# EAGLE design ac-ac-conv (EAGLE 7.3.0)

## Sheet 1 of 5: Appliance 1
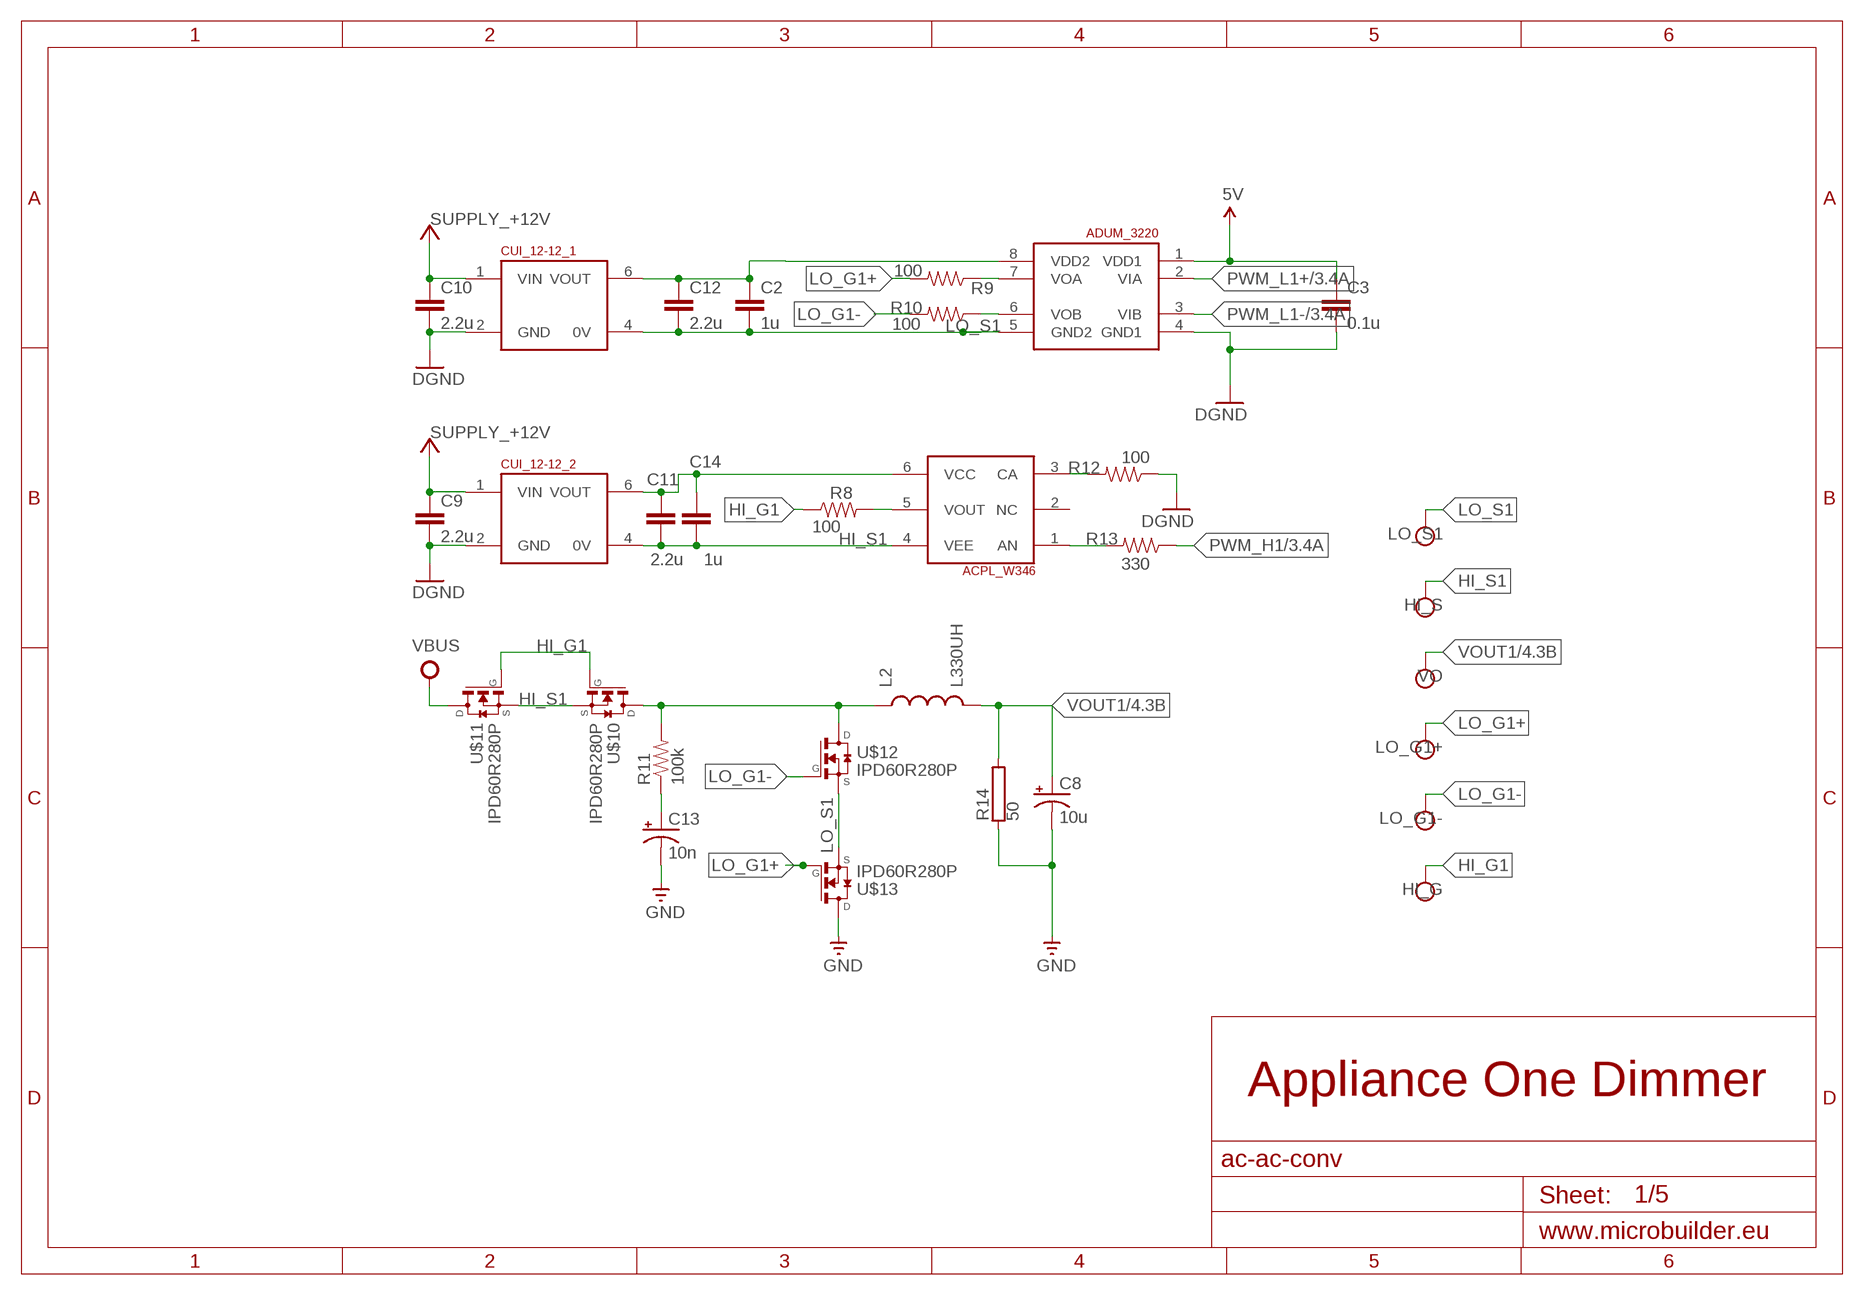
[diagram p0: schematic, sheet 1]

### Parts
ACPL_W346  ACPL-W346-SSO6  [SSO-6]
ADUM_3220  ADUM3220  [SO08]
C2  1u  CAP0603-CAP  [0603-CAP]
C3  0.1u  CAP0603-CAP  [0603-CAP]
C8  10u  CAP_POLC  [PANASONIC_C]
C9  2.2u  CAP0603-CAP  [0603-CAP]
C10  2.2u  CAP0603-CAP  [0603-CAP]
C11  2.2u  CAP0603-CAP  [0603-CAP]
C12  2.2u  CAP0603-CAP  [0603-CAP]
C13  10n  CAP_POL1206  [EIA3216]
C14  1u  CAP0603-CAP  [0603-CAP]
CUI_12-12_1  CUI-S12-S12  [CUI_PDM2]
CUI_12-12_2  CUI-S12-S12  [CUI_PDM2]
HI_G  TESTPOINT0.1"  [1X01_ROUND]
HI_S  TESTPOINT0.1"  [1X01_ROUND]
L2  L330UH  [BOUNRS_330UH]
LO_G1+  TESTPOINT0.1"  [1X01_ROUND]
LO_G1-  TESTPOINT0.1"  [1X01_ROUND]
LO_S1  TESTPOINT0.1"  [1X01_ROUND]
R8  100  RESISTOR0603-RES  [0603-RES]
R9  100  RESISTOR0603-RES  [0603-RES]
R10  100  RESISTOR0603-RES  [0603-RES]
R11  100k  RESISTOR2512  [R2512]
R12  100  RESISTOR0603-RES  [0603-RES]
R13  330  RESISTOR0603-RES  [0603-RES]
R14  50  RMG100-V  [TO-247-2V]
U$10  IPD60R280P  [DPAK]
U$11  IPD60R280P  [DPAK]
U$12  IPD60R280P  [DPAK]
U$13  IPD60R280P  [DPAK]
VO  TESTPOINT0.1"  [1X01_ROUND]

### Nets
5V: ADUM_3220.1(VDD1) C3.1 ; also sheet 2,4,5
+12V: C9.1 C10.1 CUI_12-12_1.1(VIN) CUI_12-12_2.1(VIN) ; supply symbol labelled SUPPLY_+12V ; also sheet 2,5
GND [Power]: ADUM_3220.4(GND1) C3.2 C8.- C9.2 C10.2 C13.C(-) CUI_12-12_1.2(GND) CUI_12-12_2.2(GND) R12.1 R14.1 U$13.4(D) ; supply symbol labelled DGND ; also sheet 2,3,4,5
HI_G1 [Power]: HI_G.1 R8.1 U$10.1(G) U$11.1(G)
HI_PS1: ACPL_W346.6(VCC) C11.1 C14.1 CUI_12-12_2.6(VOUT)
HI_S1: ACPL_W346.4(VEE) C11.2 C14.2 CUI_12-12_2.4(0V) HI_S.1 U$10.3(S) U$11.3(S)
LO_G1+: LO_G1+.1 R9.2 U$13.1(G)
LO_G1-: LO_G1-.1 R10.2 U$12.1(G)
LO_PS1: ADUM_3220.8(VDD2) C2.1 C12.1 CUI_12-12_1.6(VOUT)
LO_S1 [Power]: ADUM_3220.5(GND2) C2.2 C12.2 CUI_12-12_1.4(0V) LO_S1.1 U$12.3(S) U$13.3(S)
N$9 [Power]: L2.P$1 R11.2 U$10.4(D) U$12.4(D)
N$11 [Power]: C13.A(+) R11.1
N$12: ACPL_W346.3(CA) R12.2
N$13: ACPL_W346.1(AN) R13.2
N$14 [Power]: ADUM_3220.7(VOA) R9.1
N$23 [Power]: ADUM_3220.6(VOB) R10.1
PWM_H1: R13.1 ; also sheet 3,5
PWM_L1+: ADUM_3220.2(VIA) ; also sheet 3
PWM_L1-: ADUM_3220.3(VIB) ; also sheet 3
VBUS [Power]: U$11.4(D) ; also sheet 2,4
VOUT1 [Power]: C8.+ L2.P$2 R14.2 VO.1 ; also sheet 4
VOUT_H2: ACPL_W346.5(VOUT) R8.2
Unconnected: ACPL_W346.2(NC)

### Notes on the sheet
- Appliance One Dimmer

## Sheet 2 of 5: Appliance 2
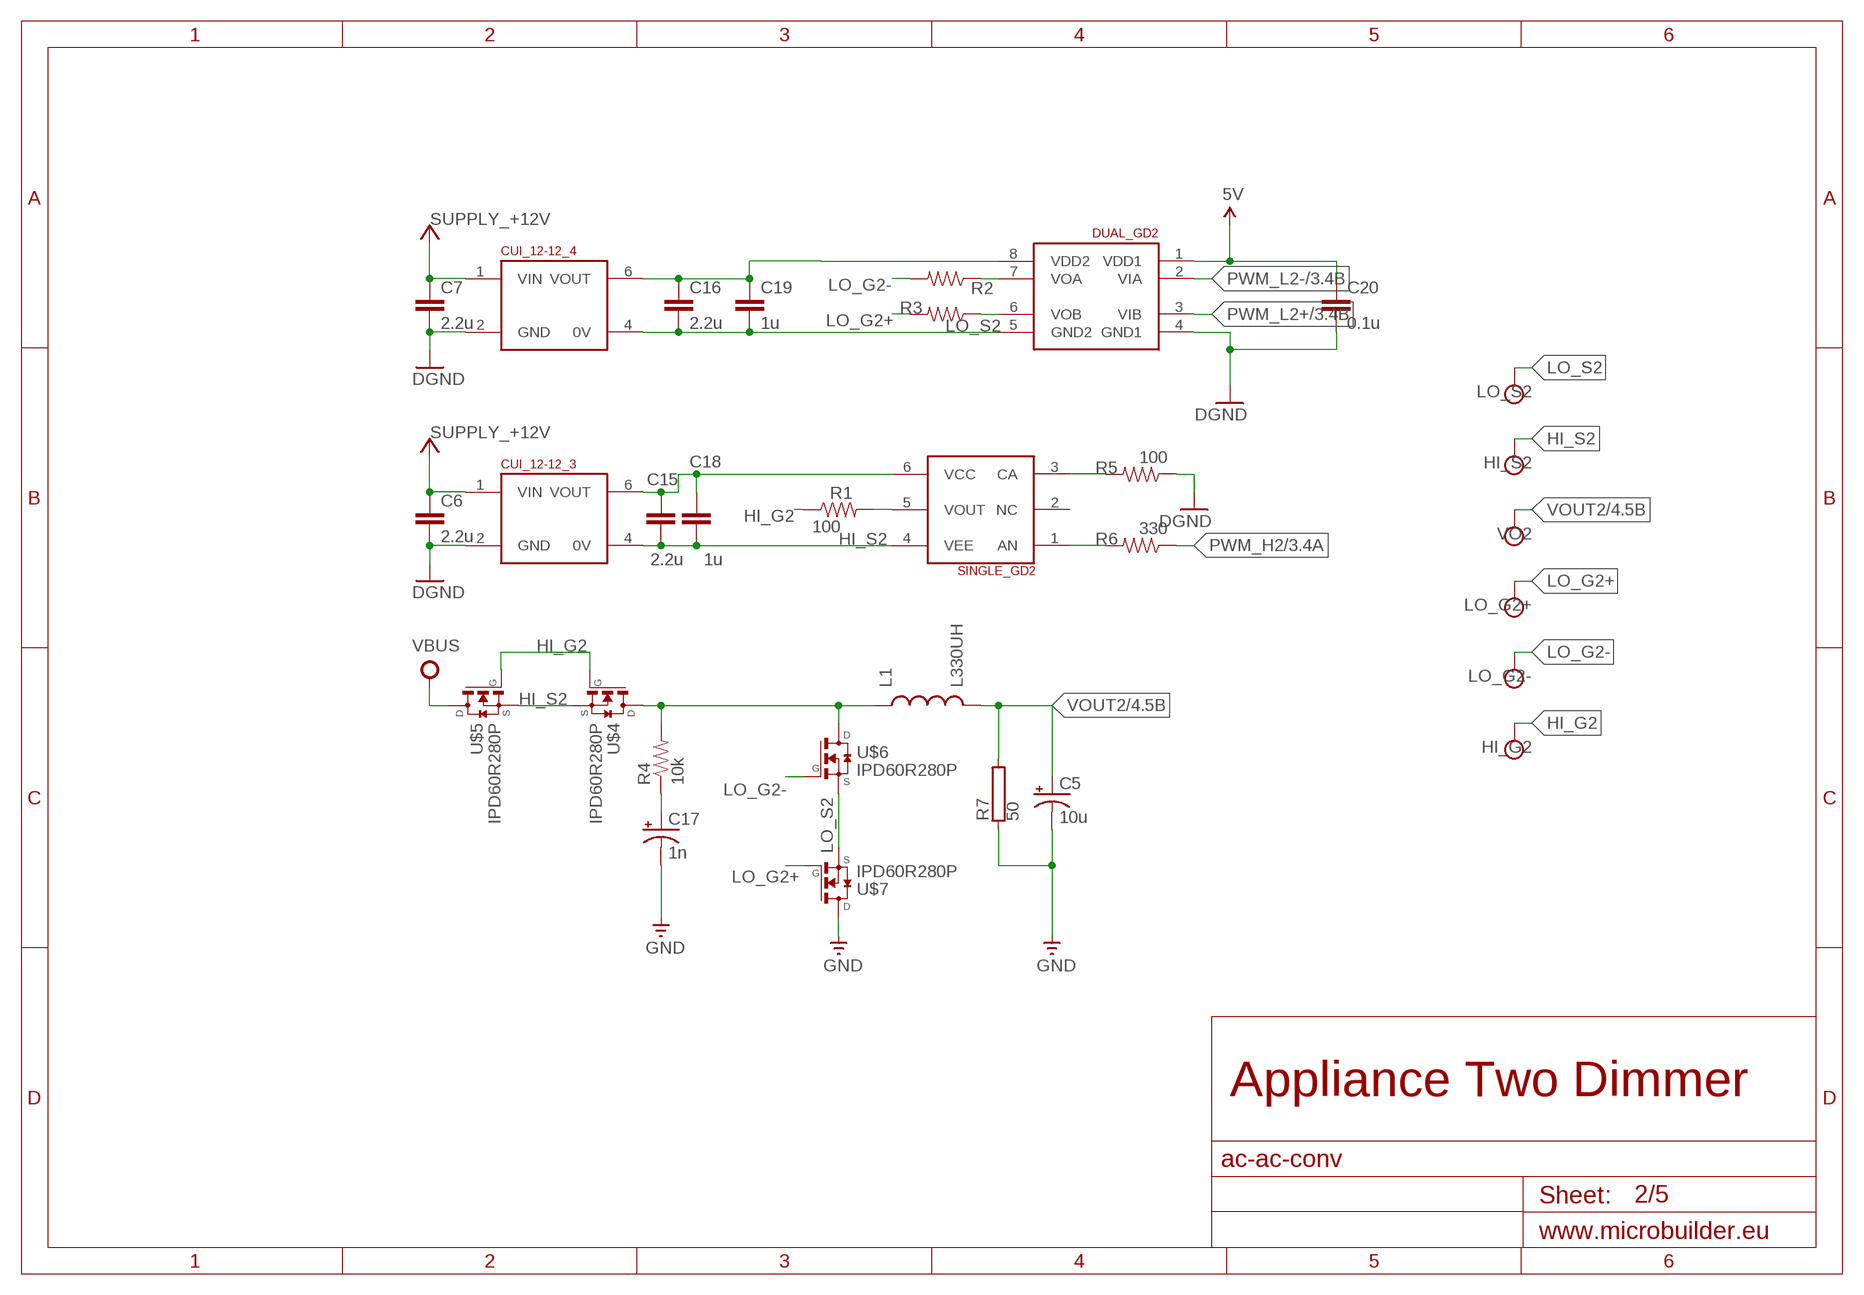
[diagram p1: schematic, sheet 2]

### Parts
C5  10u  CAP_POLC  [PANASONIC_C]
C6  2.2u  CAP0603-CAP  [0603-CAP]
C7  2.2u  CAP0603-CAP  [0603-CAP]
C15  2.2u  CAP0603-CAP  [0603-CAP]
C16  2.2u  CAP0603-CAP  [0603-CAP]
C17  1n  CAP_POL1206  [EIA3216]
C18  1u  CAP0603-CAP  [0603-CAP]
C19  1u  CAP0603-CAP  [0603-CAP]
C20  0.1u  CAP0603-CAP  [0603-CAP]
CUI_12-12_3  CUI-S12-S12  [CUI_PDM2]
CUI_12-12_4  CUI-S12-S12  [CUI_PDM2]
DUAL_GD2  ADUM3220  [SO08]
HI_G2  TESTPOINT0.1"  [1X01_ROUND]
HI_S2  TESTPOINT0.1"  [1X01_ROUND]
L1  L330UH  [BOUNRS_330UH]
LO_G2+  TESTPOINT0.1"  [1X01_ROUND]
LO_G2-  TESTPOINT0.1"  [1X01_ROUND]
LO_S2  TESTPOINT0.1"  [1X01_ROUND]
R1  100  RESISTOR0603-RES  [0603-RES]
R2  RESISTOR0603-RES  [0603-RES]
R3  RESISTOR0603-RES  [0603-RES]
R4  10k  RESISTOR2512  [R2512]
R5  100  RESISTOR0603-RES  [0603-RES]
R6  330  RESISTOR0603-RES  [0603-RES]
R7  50  RMG100-V  [TO-247-2V]
SINGLE_GD2  ACPL-W346-SSO6  [SSO-6]
U$4  IPD60R280P  [DPAK]
U$5  IPD60R280P  [DPAK]
U$6  IPD60R280P  [DPAK]
U$7  IPD60R280P  [DPAK]
VO2  TESTPOINT0.1"  [1X01_ROUND]

### Nets
5V: C20.1 DUAL_GD2.1(VDD1) ; also sheet 1,4,5
+12V: C6.1 C7.1 CUI_12-12_3.1(VIN) CUI_12-12_4.1(VIN) ; supply symbol labelled SUPPLY_+12V ; also sheet 1,5
GND [Power]: C5.- C6.2 C7.2 C17.C(-) C20.2 CUI_12-12_3.2(GND) CUI_12-12_4.2(GND) DUAL_GD2.4(GND1) R5.1 R7.1 U$7.4(D) ; supply symbol labelled DGND ; also sheet 1,3,4,5
HI_G2: HI_G2.1 R1.1 U$4.1(G) U$5.1(G)
HI_PS2: C15.1 C18.1 CUI_12-12_3.6(VOUT) SINGLE_GD2.6(VCC)
HI_S2 [Power]: C15.2 C18.2 CUI_12-12_3.4(0V) HI_S2.1 SINGLE_GD2.4(VEE) U$4.3(S) U$5.3(S)
LO_G2+: LO_G2+.1 R3.2 U$7.1(G)
LO_G2-: LO_G2-.1 R2.2 U$6.1(G)
LO_PS2: C16.1 C19.1 CUI_12-12_4.6(VOUT) DUAL_GD2.8(VDD2)
LO_S2 [Power]: C16.2 C19.2 CUI_12-12_4.4(0V) DUAL_GD2.5(GND2) LO_S2.1 U$6.3(S) U$7.3(S)
N$5 [Power]: L1.P$1 R4.2 U$4.4(D) U$6.4(D)
N$6 [Power]: C17.A(+) R4.1
N$7: R5.2 SINGLE_GD2.3(CA)
N$8: R6.2 SINGLE_GD2.1(AN)
N$24 [Power]: DUAL_GD2.7(VOA) R2.1
N$26 [Power]: DUAL_GD2.6(VOB) R3.1
PWM_H2: R6.1 ; also sheet 3,5
PWM_L2+: DUAL_GD2.3(VIB) ; also sheet 3
PWM_L2-: DUAL_GD2.2(VIA) ; also sheet 3
VBUS [Power]: U$5.4(D) ; also sheet 1,4
VOUT2 [Power]: C5.+ L1.P$2 R7.2 VO2.1 ; also sheet 4
VOUT_H1: R1.2 SINGLE_GD2.5(VOUT)
Unconnected: SINGLE_GD2.2(NC)

### Notes on the sheet
- Appliance Two Dimmer

## Sheet 3 of 5: uC
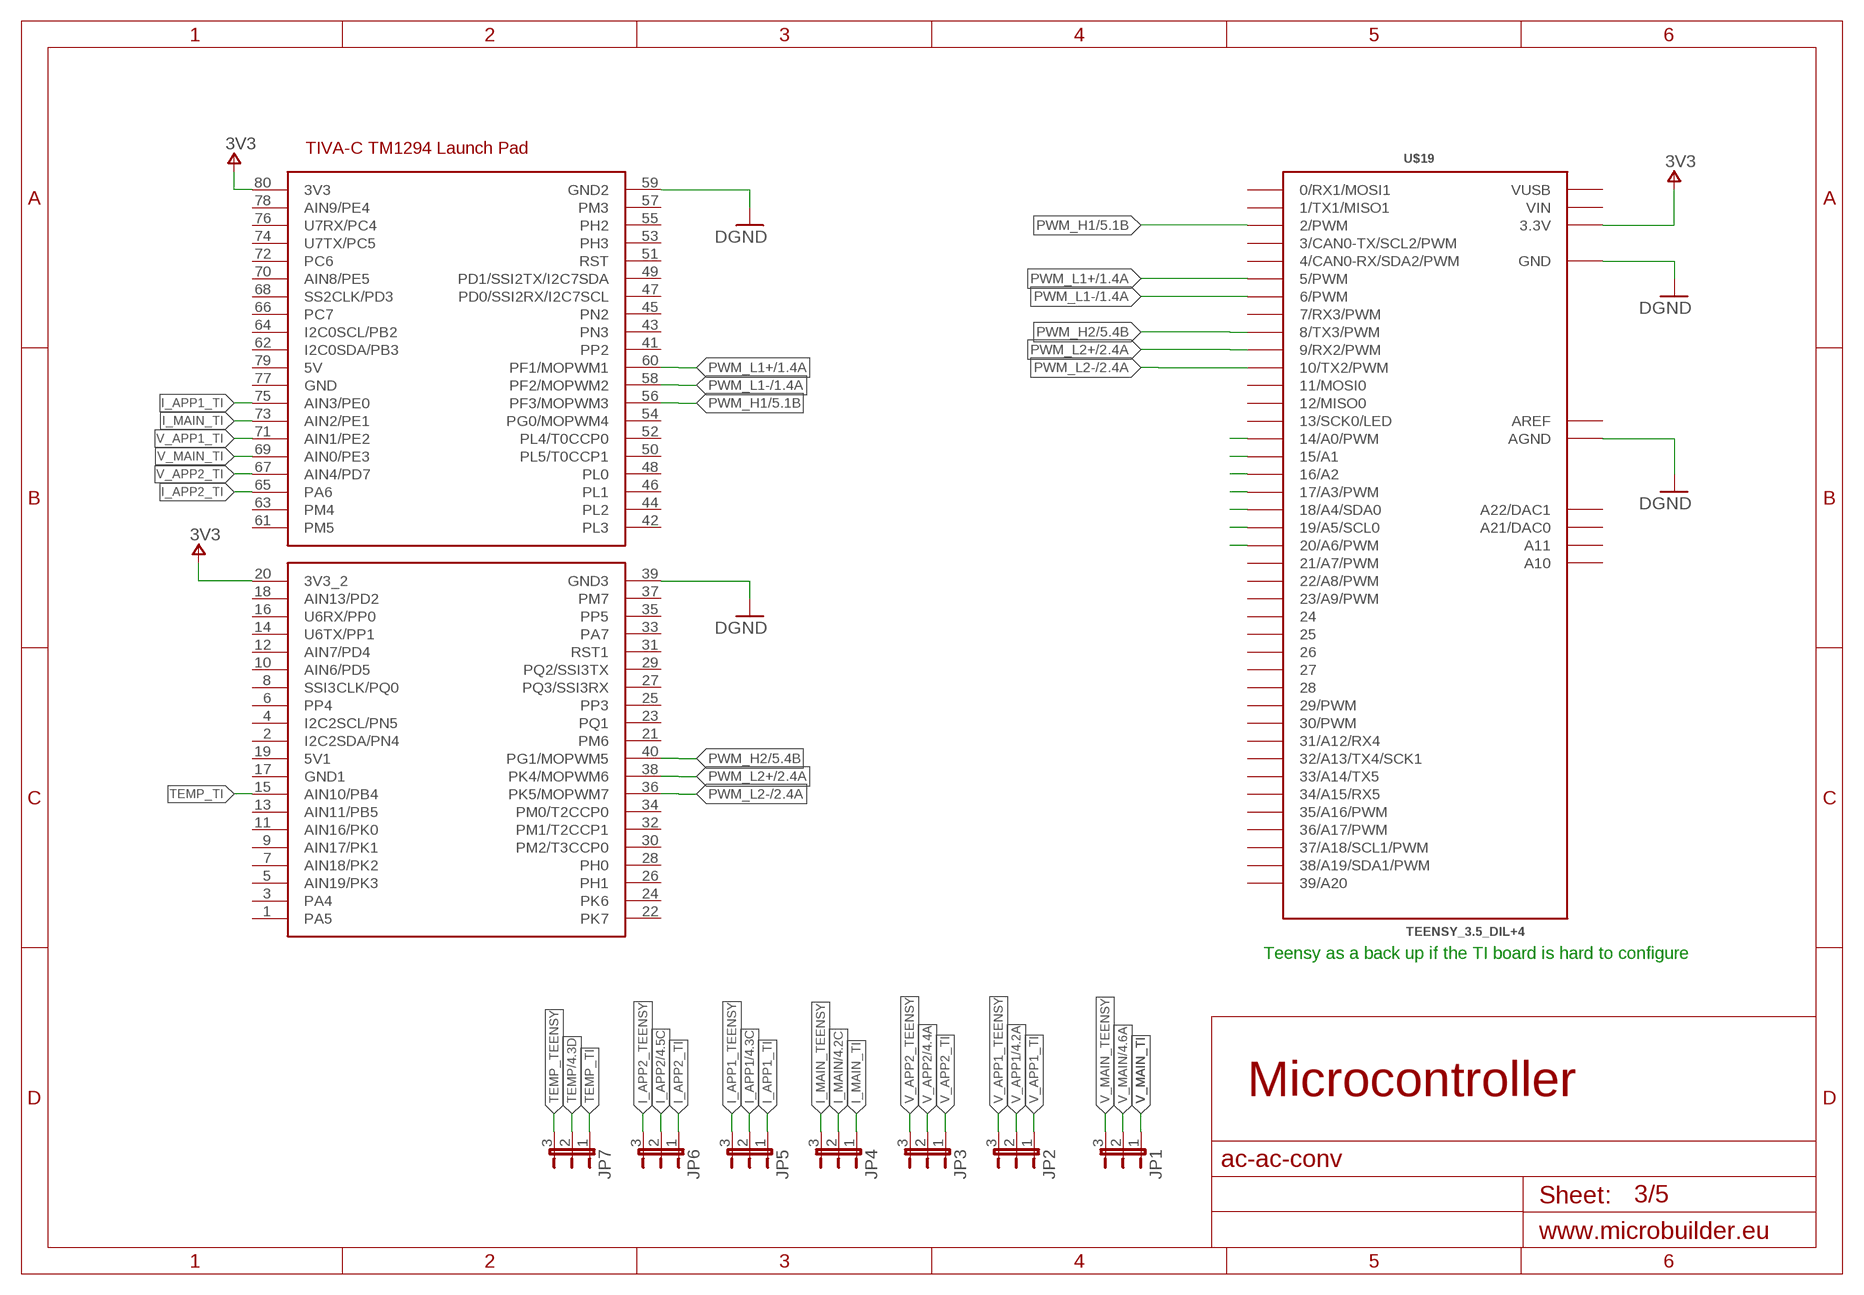
[diagram p2: schematic, sheet 3]

### Parts
JP1  JUMPER-3SMD  [SJ_3]
JP2  JUMPER-3SMD  [SJ_3]
JP3  JUMPER-3SMD  [SJ_3]
JP4  JUMPER-3SMD  [SJ_3]
JP5  JUMPER-3SMD  [SJ_3]
JP6  JUMPER-3SMD  [SJ_3]
JP7  JUMPER-3SMD  [SJ_3]
U$17  TM4C1294_SHIELD  [TIVA-C-LP-BOOSTER-PACK]
U$19  TEENSY_3.5_DIL+4  [TEENSY_3.5_DIL+4]

### Nets
3V3: U$17.20(3V3_2) U$17.80(3V3) U$19.3.3V U$19.3.3V3(3.3V) ; also sheet 4
GND [Power]: U$17.39(GND3) U$17.59(GND2) U$19.AGND U$19.GND U$19.GND1(GND) ; supply symbol labelled DGND ; also sheet 1,2,4,5
I_APP1: JP5.2 ; also sheet 4
I_APP1_TEENSY: JP5.3
I_APP1_TI: JP5.1 U$17.75(AIN3/PE0)
I_APP2: JP6.2 ; also sheet 4
I_APP2_TEENSY: JP6.3
I_APP2_TI: JP6.1 U$17.65(PA6)
I_MAIN: JP4.2 ; also sheet 4
I_MAIN_TEENSY: JP4.3
I_MAIN_TI: JP4.1 U$17.73(AIN2/PE1)
N$16: U$19.14/A0(14/A0/PWM)
N$18: U$19.15/A1
N$20: U$19.16/A2
N$21: U$19.17/A3(17/A3/PWM)
N$25: U$19.18/A4(18/A4/SDA0)
N$27: U$19.19/A5(19/A5/SCL0)
N$41: U$19.20/A6(20/A6/PWM)
PWM_H1: U$17.56(PF3/MOPWM3) U$19.2(2/PWM) ; also sheet 1,5
PWM_H2: U$17.40(PG1/MOPWM5) U$19.8(8/TX3/PWM) ; also sheet 2,5
PWM_L1+: U$17.60(PF1/MOPWM1) U$19.5(5/PWM) ; also sheet 1
PWM_L1-: U$17.58(PF2/MOPWM2) U$19.6(6/PWM) ; also sheet 1
PWM_L2+: U$17.38(PK4/MOPWM6) U$19.9(9/RX2/PWM) ; also sheet 2
PWM_L2-: U$17.36(PK5/MOPWM7) U$19.10(10/TX2/PWM) ; also sheet 2
TEMP: JP7.2 ; also sheet 4
TEMP_TEENSY: JP7.3
TEMP_TI: JP7.1 U$17.15(AIN10/PB4)
V_APP1: JP2.2 ; also sheet 4
V_APP1_TEENSY: JP2.3
V_APP1_TI: JP2.1 U$17.71(AIN1/PE2)
V_APP2: JP3.2 ; also sheet 4
V_APP2_TEENSY: JP3.3
V_APP2_TI: JP3.1 U$17.67(AIN4/PD7)
V_MAIN: JP1.2 ; also sheet 4
V_MAIN_TEENSY: JP1.3
V_MAIN_TI: JP1.1 U$17.69(AIN0/PE3)
Unconnected: U$17.1(PA5) U$17.2(I2C2SDA/PN4) U$17.3(PA4) U$17.4(I2C2SCL/PN5) U$17.5(AIN19/PK3) U$17.6(PP4) U$17.7(AIN18/PK2) U$17.8(SSI3CLK/PQ0) U$17.9(AIN17/PK1) U$17.10(AIN6/PD5) U$17.11(AIN16/PK0) U$17.12(AIN7/PD4) U$17.13(AIN11/PB5) U$17.14(U6TX/PP1) U$17.16(U6RX/PP0) U$17.17(GND1) U$17.18(AIN13/PD2) U$17.19(5V1) U$17.21(PM6) U$17.22(PK7) U$17.23(PQ1) U$17.24(PK6) U$17.25(PP3) U$17.26(PH1) U$17.27(PQ3/SSI3RX) U$17.28(PH0) U$17.29(PQ2/SSI3TX) U$17.30(PM2/T3CCP0) U$17.31(RST1) U$17.32(PM1/T2CCP1) U$17.33(PA7) U$17.34(PM0/T2CCP0) U$17.35(PP5) U$17.37(PM7) U$17.41(PP2) U$17.42(PL3) U$17.43(PN3) U$17.44(PL2) U$17.45(PN2) U$17.46(PL1) U$17.47(PD0/SSI2RX/I2C7SCL) U$17.48(PL0) U$17.49(PD1/SSI2TX/I2C7SDA) U$17.50(PL5/T0CCP1) U$17.51(RST) U$17.52(PL4/T0CCP0) U$17.53(PH3) U$17.54(PG0/MOPWM4) U$17.55(PH2) U$17.57(PM3) U$17.61(PM5) U$17.62(I2C0SDA/PB3) U$17.63(PM4) U$17.64(I2C0SCL/PB2) U$17.66(PC7) U$17.68(SS2CLK/PD3) U$17.70(AIN8/PE5) U$17.72(PC6) U$17.74(U7TX/PC5) U$17.76(U7RX/PC4) U$17.77(GND) U$17.78(AIN9/PE4) U$17.79(5V) U$19.0(0/RX1/MOSI1) U$19.1(1/TX1/MISO1) U$19.3(3/CAN0-TX/SCL2/PWM) U$19.4(4/CAN0-RX/SDA2/PWM) U$19.7(7/RX3/PWM) U$19.11(11/MOSI0) U$19.12(12/MISO0) U$19.13(13/SCK0/LED) U$19.21/A7(21/A7/PWM) U$19.22/A8(22/A8/PWM) U$19.23/A9(23/A9/PWM) U$19.24 U$19.25 U$19.26 U$19.27 U$19.28 U$19.29(29/PWM) U$19.30(30/PWM) U$19.31/A12(31/A12/RX4) U$19.32/A13(32/A13/TX4/SCK1) U$19.33/A14(33/A14/TX5) U$19.34/A15(34/A15/RX5) U$19.35/A16(35/A16/PWM) U$19.36/A17(36/A17/PWM) U$19.37/A18(37/A18/SCL1/PWM) U$19.38/A19(38/A19/SDA1/PWM) U$19.39/A20 U$19.A10 U$19.A11 U$19.A21(A21/DAC0) U$19.A22(A22/DAC1)

### Notes on the sheet
- Teensy as a back up if the TI board is hard to configure
- Microcontroller

## Sheet 4 of 5: Sensors
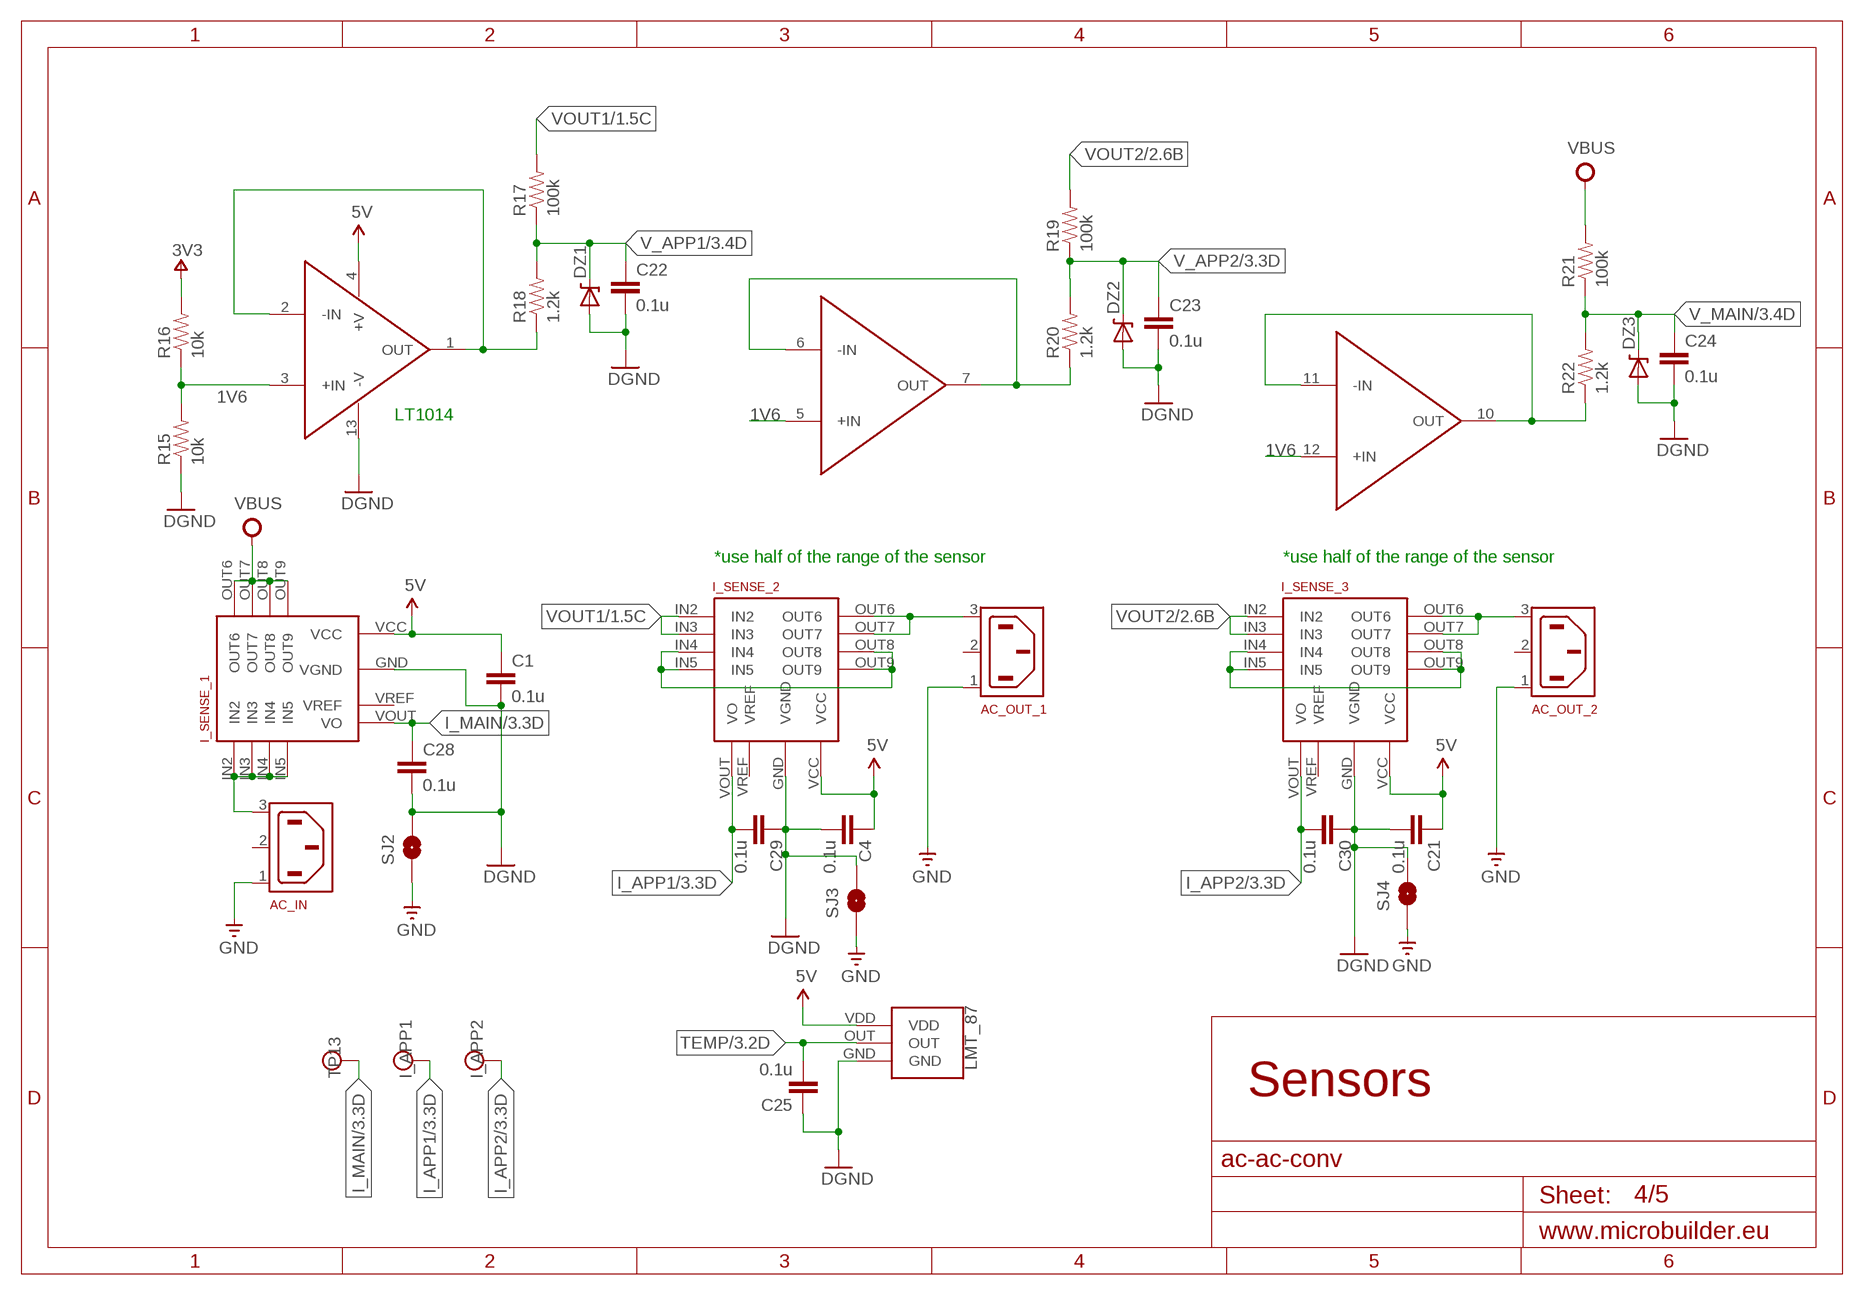
[diagram p3: schematic, sheet 4]

### Parts
AC_IN  6ESRM-P  [6ESRM-P]
AC_OUT_1  6ESRM-P  [6ESRM-P]
AC_OUT_2  6ESRM-P  [6ESRM-P]
C1  0.1u  CAP0603-CAP  [0603-CAP]
C4  0.1u  CAP0603-CAP  [0603-CAP]
C21  0.1u  CAP0603-CAP  [0603-CAP]
C22  0.1u  CAP0603-CAP  [0603-CAP]
C23  0.1u  CAP0603-CAP  [0603-CAP]
C24  0.1u  CAP0603-CAP  [0603-CAP]
C25  0.1u  CAP0603-CAP  [0603-CAP]
C28  0.1u  CAP0603-CAP  [0603-CAP]
C29  0.1u  CAP0603-CAP  [0603-CAP]
C30  0.1u  CAP0603-CAP  [0603-CAP]
DZ1  DIODE-ZENER-BZT52  [SOD-323]
DZ2  DIODE-ZENER-BZT52  [SOD-323]
DZ3  DIODE-ZENER-BZT52  [SOD-323]
I_APP1  TESTPOINT0.1"  [1X01_ROUND]
I_APP2  TESTPOINT0.1"  [1X01_ROUND]
I_SENSE_1  F03PS05  [F03P_THRU_HOLE]
I_SENSE_2  F03PS05  [F03P_THRU_HOLE]
I_SENSE_3  F03PS05  [F03P_THRU_HOLE]
LMT_87  LMT87_PAC  [LMT87_TO]
R15  10k  RESISTOR0603-RES  [0603-RES]
R16  10k  RESISTOR0603-RES  [0603-RES]
R17  100k  RESISTOR1206  [1206]
R18  1.2k  RESISTOR1206  [1206]
R19  100k  RESISTOR1206  [1206]
R20  1.2k  RESISTOR1206  [1206]
R21  100k  RESISTOR1206  [1206]
R22  1.2k  RESISTOR1206  [1206]
SJ2  SOLDERJUMPERNC2  [SJ_2S-NOTRACE]
SJ3  SOLDERJUMPERNC2  [SJ_2S-NOTRACE]
SJ4  SOLDERJUMPERNC2  [SJ_2S-NOTRACE]
TP13  TESTPOINT0.1"  [1X01_ROUND]
U$15  LT1014  [SO16L]

### Nets
1V6: R15.2 R16.1 U$15.3(+IN) U$15.5(+IN) U$15.12(+IN)
3V3: R16.2 ; also sheet 3
5V: C1.1 C4.1 C21.1 I_SENSE_1.VCC I_SENSE_2.VCC I_SENSE_3.VCC LMT_87.VDD U$15.4(+V) ; also sheet 1,2,5
DGND [Power]: C1.2 C4.2 C21.2 C28.2 C29.1 C30.1 I_SENSE_1.GND(VGND) I_SENSE_2.GND(VGND) I_SENSE_3.GND(VGND) SJ2.2 SJ3.2 SJ4.2
GND [Power]: AC_IN.1(AC1) AC_OUT_1.1(AC1) AC_OUT_2.1(AC1) C22.2 C23.2 C24.2 C25.1 DZ1.2(A) DZ2.2(A) DZ3.2(A) LMT_87.GND R15.1 SJ2.1 SJ3.1 SJ4.1 U$15.13(-V) ; supply symbol labelled DGND ; also sheet 1,2,3,5
I_APP1: C29.2 I_APP1.1 I_SENSE_2.VOUT(VO) ; also sheet 3
I_APP2: C30.2 I_APP2.1 I_SENSE_3.VOUT(VO) ; also sheet 3
I_MAIN: C28.1 I_SENSE_1.VOUT(VO) TP13.1 ; also sheet 3
N$1 [Power]: AC_IN.3(AC2) I_SENSE_1.IN2 I_SENSE_1.IN3 I_SENSE_1.IN4 I_SENSE_1.IN5
N$2 [Power]: I_SENSE_2.IN4 I_SENSE_2.IN5 I_SENSE_2.OUT8 I_SENSE_2.OUT9
N$3 [Power]: I_SENSE_3.IN4 I_SENSE_3.IN5 I_SENSE_3.OUT8 I_SENSE_3.OUT9
N$4 [Power]: AC_OUT_1.3(AC2) I_SENSE_2.OUT6 I_SENSE_2.OUT7
N$10 [Power]: AC_OUT_2.3(AC2) I_SENSE_3.OUT6 I_SENSE_3.OUT7
N$15: R18.1 U$15.1(OUT) U$15.2(-IN)
N$17: R22.1 U$15.10(OUT) U$15.11(-IN)
N$19: R20.1 U$15.6(-IN) U$15.7(OUT)
TEMP: C25.2 LMT_87.OUT ; also sheet 3
V_APP1: C22.1 DZ1.1(C) R17.1 R18.2 ; also sheet 3
V_APP2: C23.1 DZ2.1(C) R19.1 R20.2 ; also sheet 3
V_MAIN: C24.1 DZ3.1(C) R21.1 R22.2 ; also sheet 3
VBUS [Power]: I_SENSE_1.OUT6 I_SENSE_1.OUT7 I_SENSE_1.OUT8 I_SENSE_1.OUT9 R21.2 ; also sheet 1,2
VOUT1 [Power]: I_SENSE_2.IN2 I_SENSE_2.IN3 R17.2 ; also sheet 1
VOUT2 [Power]: I_SENSE_3.IN2 I_SENSE_3.IN3 R19.2 ; also sheet 2
Unconnected: AC_IN.2(SH) AC_OUT_1.2(SH) AC_OUT_2.2(SH) I_SENSE_1.VREF I_SENSE_2.VREF I_SENSE_3.VREF

### Notes on the sheet
- LT1014
- *use half of the range of the sensor | *use half of the range of the sensor
- Sensors

## Sheet 5 of 5: Power
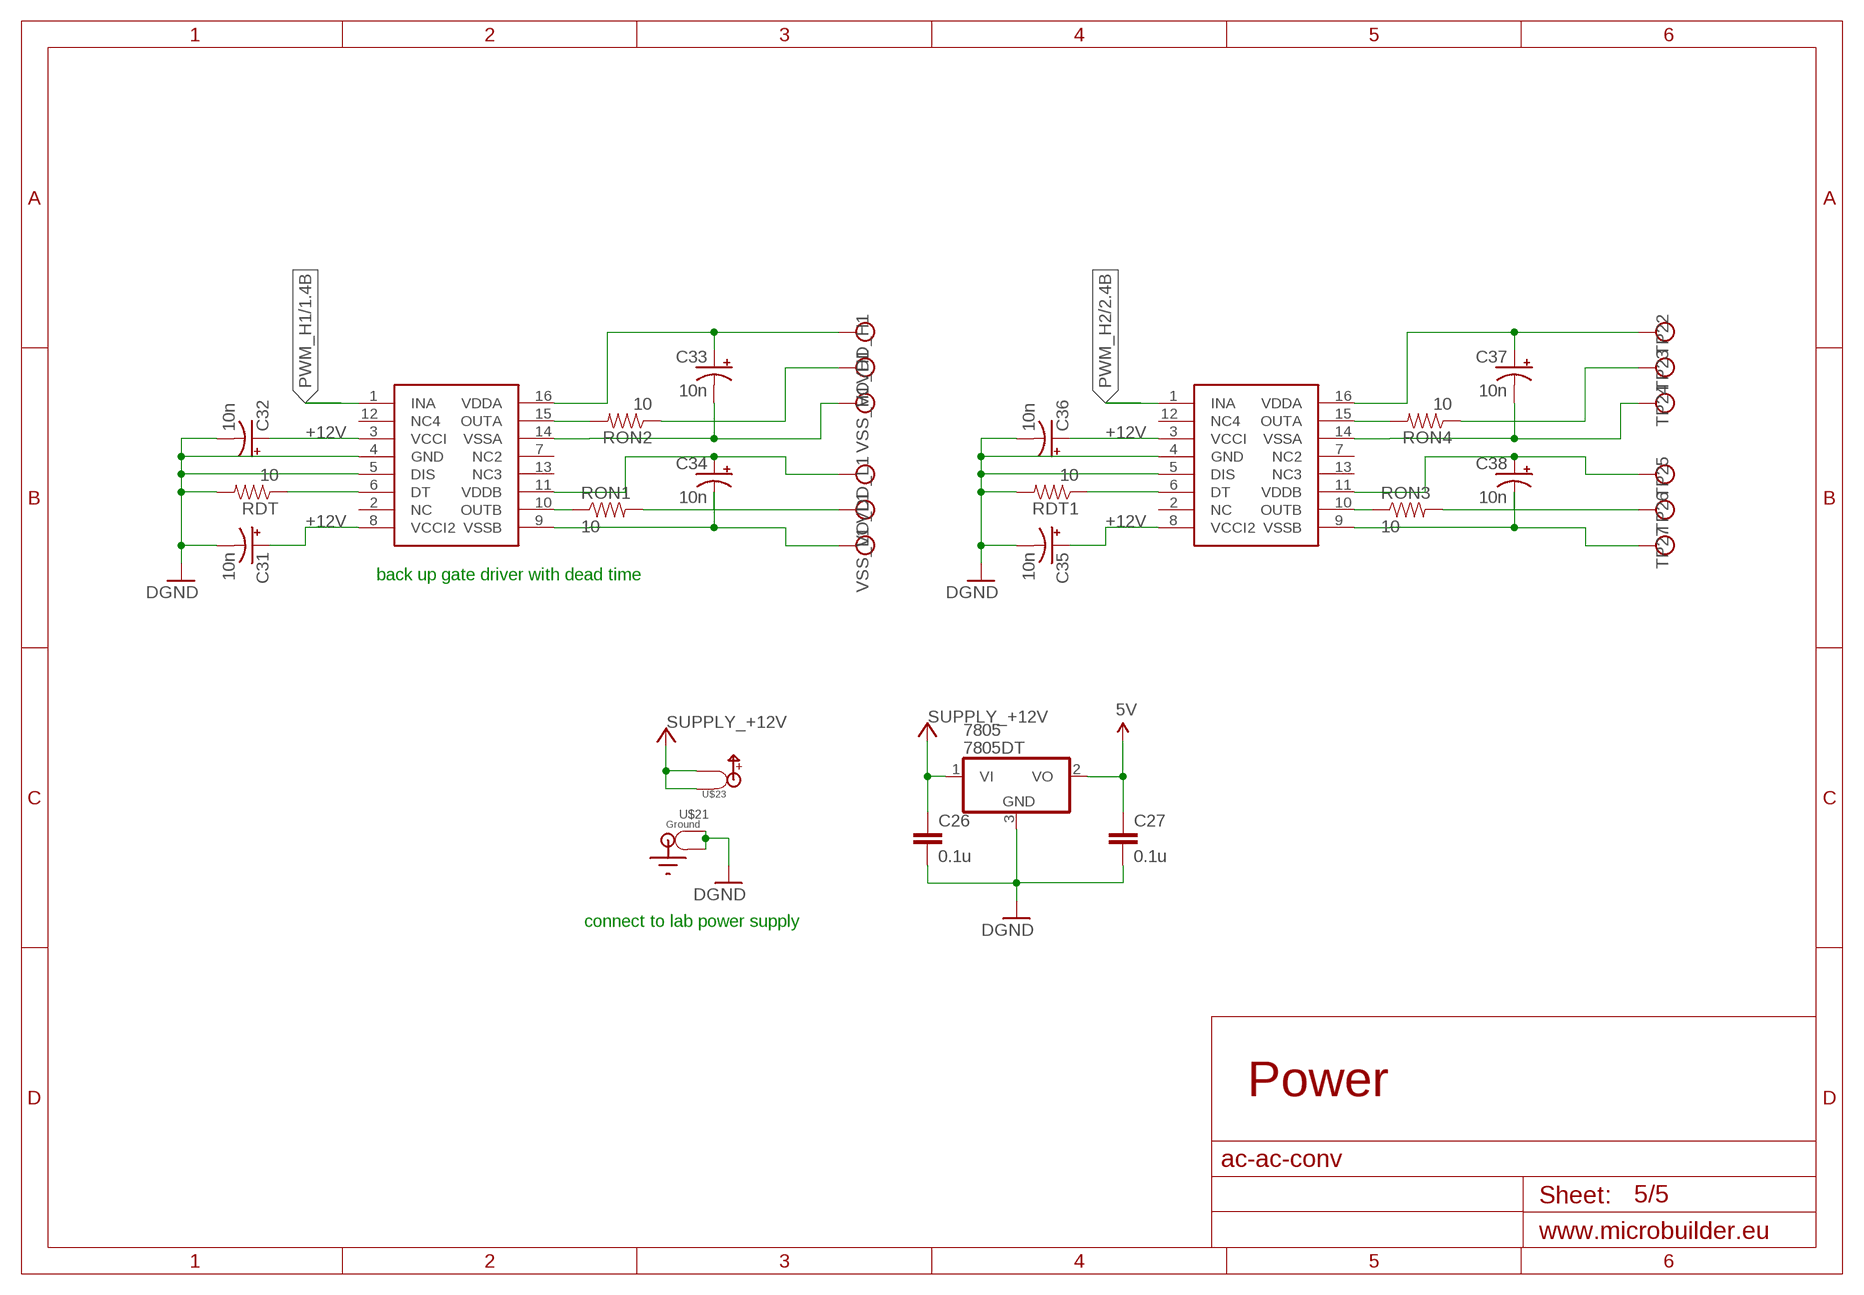
[diagram p4: schematic, sheet 5]

### Parts
7805  7805DT  [TO252]
C26  0.1u  CAP0603-CAP  [0603-CAP]
C27  0.1u  CAP0603-CAP  [0603-CAP]
C31  10n  CAP_POL1206  [EIA3216]
C32  10n  CAP_POL1206  [EIA3216]
C33  10n  CAP_POL1206  [EIA3216]
C34  10n  CAP_POL1206  [EIA3216]
C35  10n  CAP_POL1206  [EIA3216]
C36  10n  CAP_POL1206  [EIA3216]
C37  10n  CAP_POL1206  [EIA3216]
C38  10n  CAP_POL1206  [EIA3216]
RDT  10  RESISTOR0603-RES  [0603-RES]
RDT1  10  RESISTOR0603-RES  [0603-RES]
RON1  10  RESISTOR0603-RES  [0603-RES]
RON2  10  RESISTOR0603-RES  [0603-RES]
RON3  10  RESISTOR0603-RES  [0603-RES]
RON4  10  RESISTOR0603-RES  [0603-RES]
TP22  TESTPOINT0.1"  [1X01_ROUND]
TP23  TESTPOINT0.1"  [1X01_ROUND]
TP24  TESTPOINT0.1"  [1X01_ROUND]
TP25  TESTPOINT0.1"  [1X01_ROUND]
TP26  TESTPOINT0.1"  [1X01_ROUND]
TP27  TESTPOINT0.1"  [1X01_ROUND]
U$1  UCC20520  [SO16]
U$9  UCC20520  [SO16]
U$21  SPADE-GROUND  [SPADE-GROUND]
U$23  SPADE-POWER  [SPADE-POWER]
VDD_H1  TESTPOINT0.1"  [1X01_ROUND]
VDD_L1  TESTPOINT0.1"  [1X01_ROUND]
VO_H1  TESTPOINT0.1"  [1X01_ROUND]
VO_L1  TESTPOINT0.1"  [1X01_ROUND]
VSS_H1  TESTPOINT0.1"  [1X01_ROUND]
VSS_L1  TESTPOINT0.1"  [1X01_ROUND]

### Nets
5V: 7805.2(VO) C27.1 ; also sheet 1,2,4
+12V: 7805.1(VI) C26.1 C31.A(+) C32.A(+) C35.A(+) C36.A(+) U$1.3(VCCI) U$1.8(VCCI2) U$9.3(VCCI) U$9.8(VCCI2) U$23.P$1 U$23.P$2 ; supply symbol labelled SUPPLY_+12V ; also sheet 1,2
GND [Power]: 7805.3(GND) C26.2 C27.2 C31.C(-) C32.C(-) C35.C(-) C36.C(-) RDT1.2 RDT.2 U$1.4(GND) U$1.5(DIS) U$9.4(GND) U$9.5(DIS) U$21.P$1 U$21.P$2 ; supply symbol labelled DGND ; also sheet 1,2,3,4
N$22: C33.A(+) U$1.16(VDDA) VDD_H1.1
N$29: RON1.1 U$1.10(OUTB)
N$30: RDT.1 U$1.6(DT)
N$32: C33.C(-) U$1.14(VSSA) VSS_H1.1
N$33: C34.A(+) U$1.11(VDDB) VDD_L1.1
N$34: RON1.2 VO_L1.1
N$35: C34.C(-) U$1.9(VSSB) VSS_L1.1
N$36: RON2.2 U$1.15(OUTA)
N$37: RON2.1 VO_H1.1
N$38: RDT1.1 U$9.6(DT)
N$39: C37.A(+) TP22.1 U$9.16(VDDA)
N$40: C37.C(-) TP24.1 U$9.14(VSSA)
N$42: C38.C(-) TP27.1 U$9.9(VSSB)
N$43: C38.A(+) TP25.1 U$9.11(VDDB)
N$44: RON3.1 U$9.10(OUTB)
N$45: RON3.2 TP26.1
N$46: RON4.2 U$9.15(OUTA)
N$47: RON4.1 TP23.1
PWM_H1: U$1.1(INA) ; also sheet 1,3
PWM_H2: U$9.1(INA) ; also sheet 2,3
Unconnected: U$1.2(NC) U$1.7(NC2) U$1.12(NC4) U$1.13(NC3) U$9.2(NC) U$9.7(NC2) U$9.12(NC4) U$9.13(NC3)

### Notes on the sheet
- back up gate driver with dead time
- connect to lab power supply
- Power

## Power pins joined to a net without a drawn wire
+IN: U$15.14(+IN)
-IN: U$15.15(-IN)
AREF: U$19.AREF
OUT: U$15.16(OUT)
VIN: U$19.VIN
VUSB: U$19.VUSB

## Library data of the parts
7805 = linear:78*: Positive VOLTAGE REGULATOR Source: http://cache.national.com/ds/LM/LM78L05.pdf http://www.fairchildsemi.com/ds/LM/LM7805.pdf
AC_IN AC_OUT_1 AC_OUT_2 = con-tycoelectronics:6ESRM-P: AC Connector 120/250 VAC Source: http://catalog.tycoelectronics.com .. ENG_DS_1654001_1099_SR_0406.pdf; MF: TYCO ELECTRONICS; MPN: 6ESRM-P; OC_FARNELL: unknown; OC_NEWARK: 87F1821
ACPL_W346 SINGLE_GD2 = Francis-Project:ACPL-W346-SSO6
ADUM_3220 DUAL_GD2 = Francis-Project:ADUM3220
C1-C4 C6 C7 C9-C12 C14-C16 C18-C30 = SparkFun:CAP: Capacitor Standard 0603 ceramic capacitor, and 0.1" leaded capacitor.
C5 C8 C13 C17 C31-C38 = SparkFun:CAP_POL: Capacitor Polarized These are standard SMD and PTH capacitors. Normally 10uF, 47uF, and 100uF in electrolytic and tantalum varieties. Always verify the external diameter of the through hole cap, it varies with capacity, voltage, and manufacturer. The EIA devices should be standard.
CUI_12-12_1-CUI_12-12_4 = Francis-Project:CUI-S12-S12
DZ1-DZ3 = SparkFun:DIODE-ZENER: Zener Diode Production Part - 8199 3.4V Zener Voltage
HI_G HI_G2 HI_S HI_S2 I_APP1 I_APP2 LO_G1+ LO_G1- LO_G2+ LO_G2- LO_S1 LO_S2 TP13 TP22-TP27 VDD_H1 VDD_L1 VO VO2 VO_H1 VO_L1 VSS_H1 VSS_L1 = microbuilder:TESTPOINT: Test Point Various test points for characterisation and PCB testing TESTPOINT_SMT - Compact Surface Mount Test Point [Digikey: 5016KTR-ND]; BOM: EXCLUDE
I_SENSE_1-I_SENSE_3 = Francis-Project:F03PS05
JP1-JP7 = SparkFun:JUMPER-3
L1 L2 = Francis-Project:L330UH
LMT_87 = nick:LMT87_PAC
R1-R3 R5 R6 R8-R10 R12 R13 R15-R22 RDT RDT1 RON1-RON4 = SparkFun:RESISTOR: Resistor
R4 R11 = SparkFun-Passives:RESISTOR: Resistor
R7 R14 = resistor-power:RMG100: TO-247 Power Resistor - RMG 100 Series Source: www.token.com.tw .. power-resistor-rmg100pdf; OC_FARNELL: unknown; OC_NEWARK: unknown
SJ2-SJ4 = SparkFun:SOLDERJUMPER: Solder Jumper Standard SMD solder jumper. Used to automate production. Two varients : Normally Open and Normally Closed are the same, but have different paste layers. NC will have a large amount of paste and should jumper during reflow.
U$1 U$9 = Francis-Project:UCC20520
U$4-U$7 U$10-U$13 = Francis-Project:IPD60R280P
U$15 = SparkFun-AnalogIC:LT1014: Precision quad op-amp. I/O range includes negative rail.
U$17 = Francis-Project:TM4C1294_SHIELD
U$19 = Teensy_3_and_LC_Series_Boards_v1.4:TEENSY_3.5_DIL+4: DIL version of Teensy 3.5 plus the VUSB/A10/A11/AREF PINS
U$21 = Spade-terminals:SPADE-GROUND: 0.25" spade terminal
U$23 = Spade-terminals:SPADE-POWER: 0.25" SPADE

## Net classes
1 Power: clearance 0.508 mm

## Board
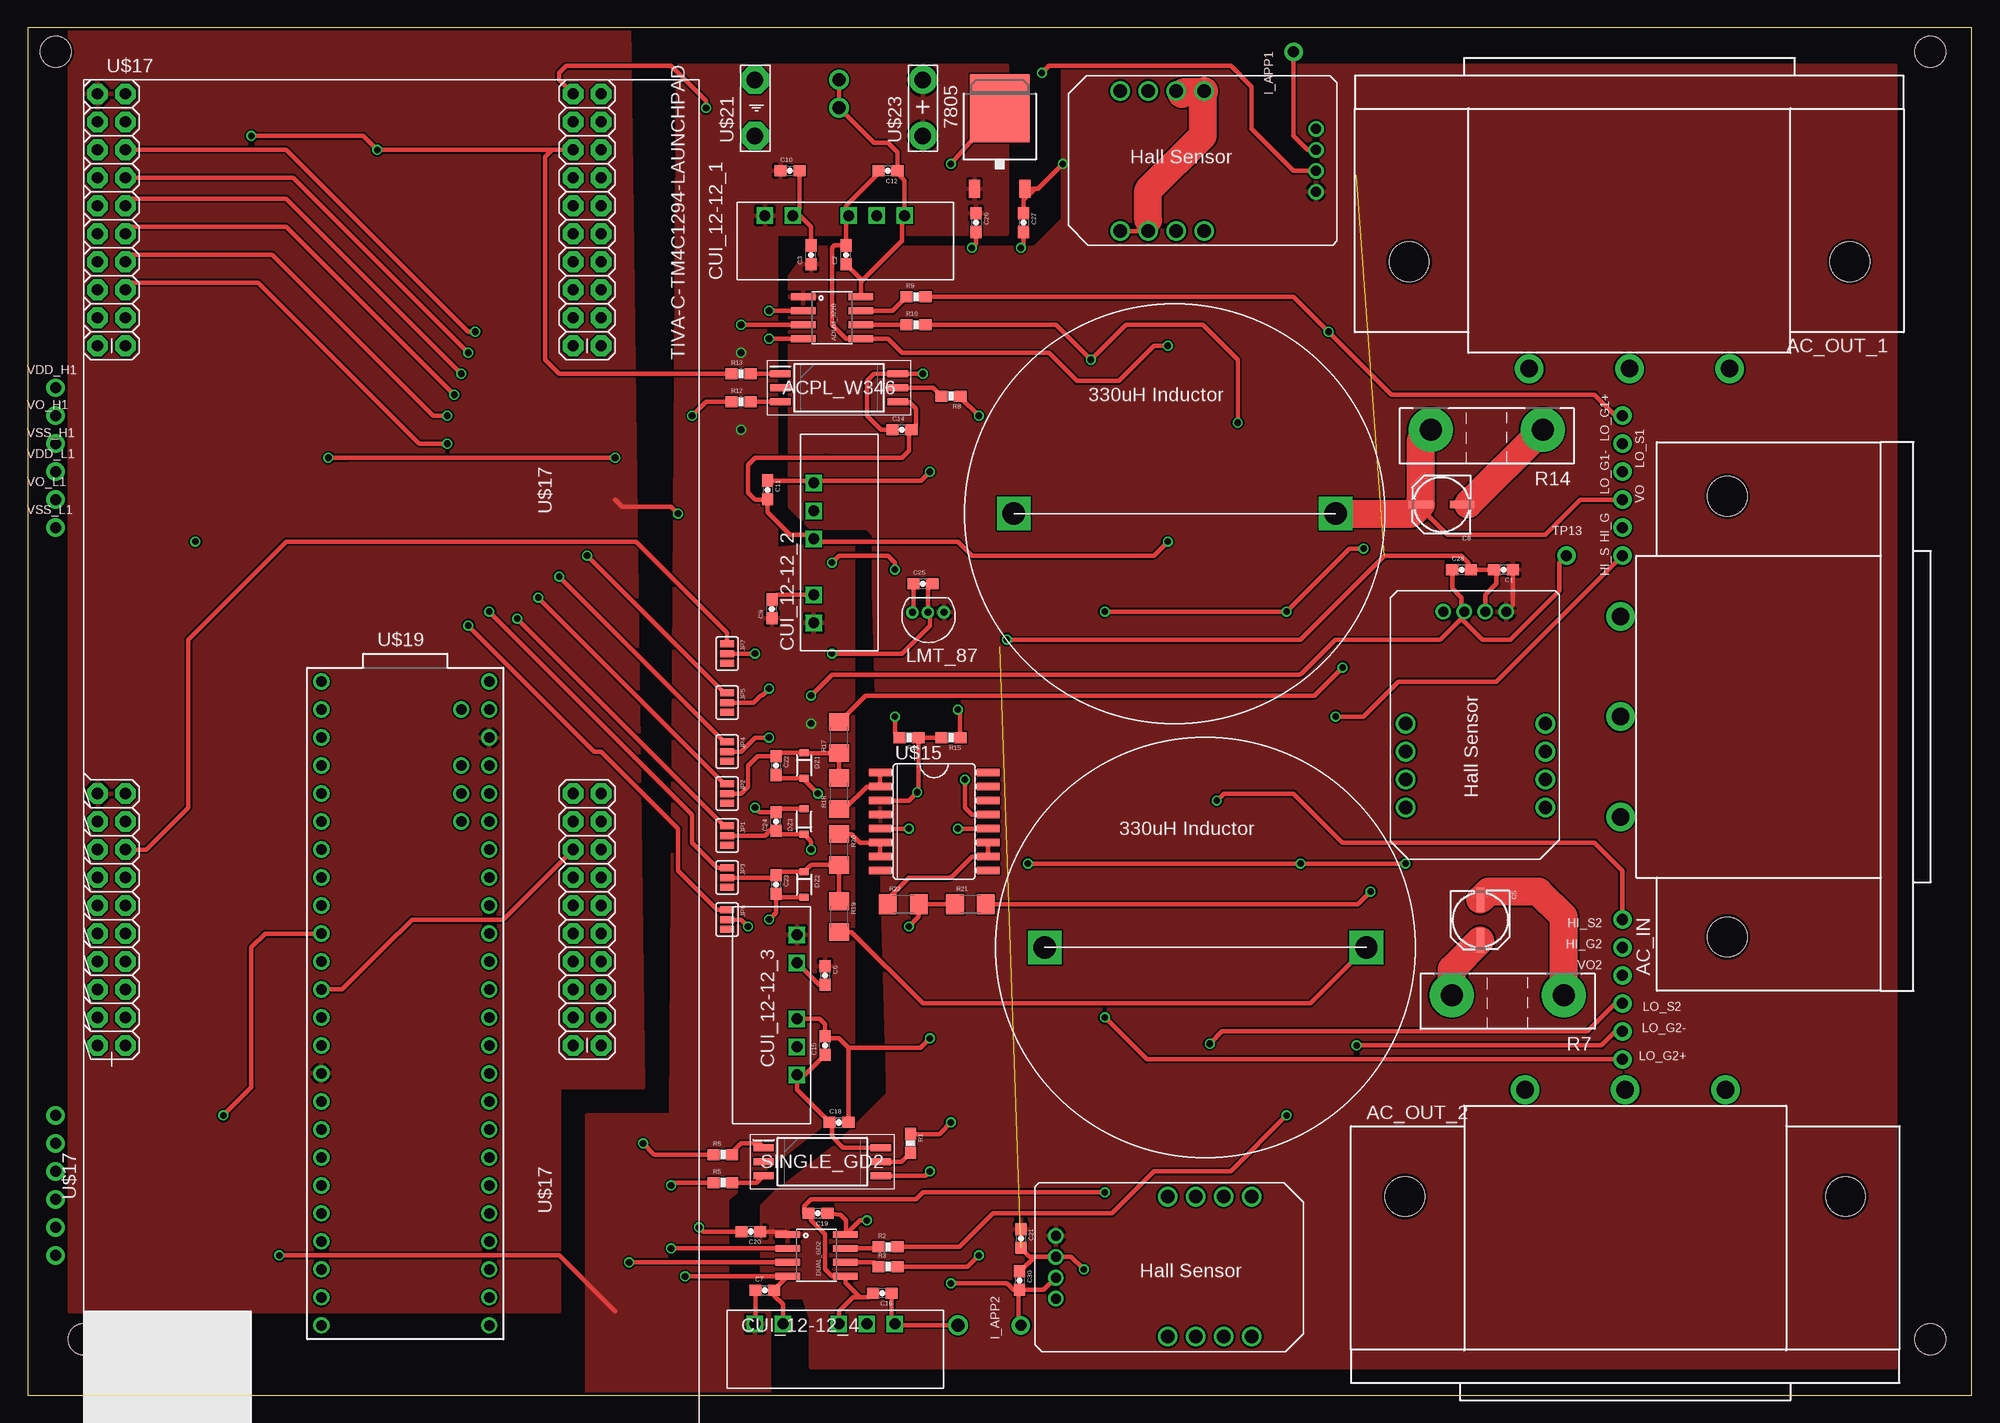
[diagram p5: board, top side]
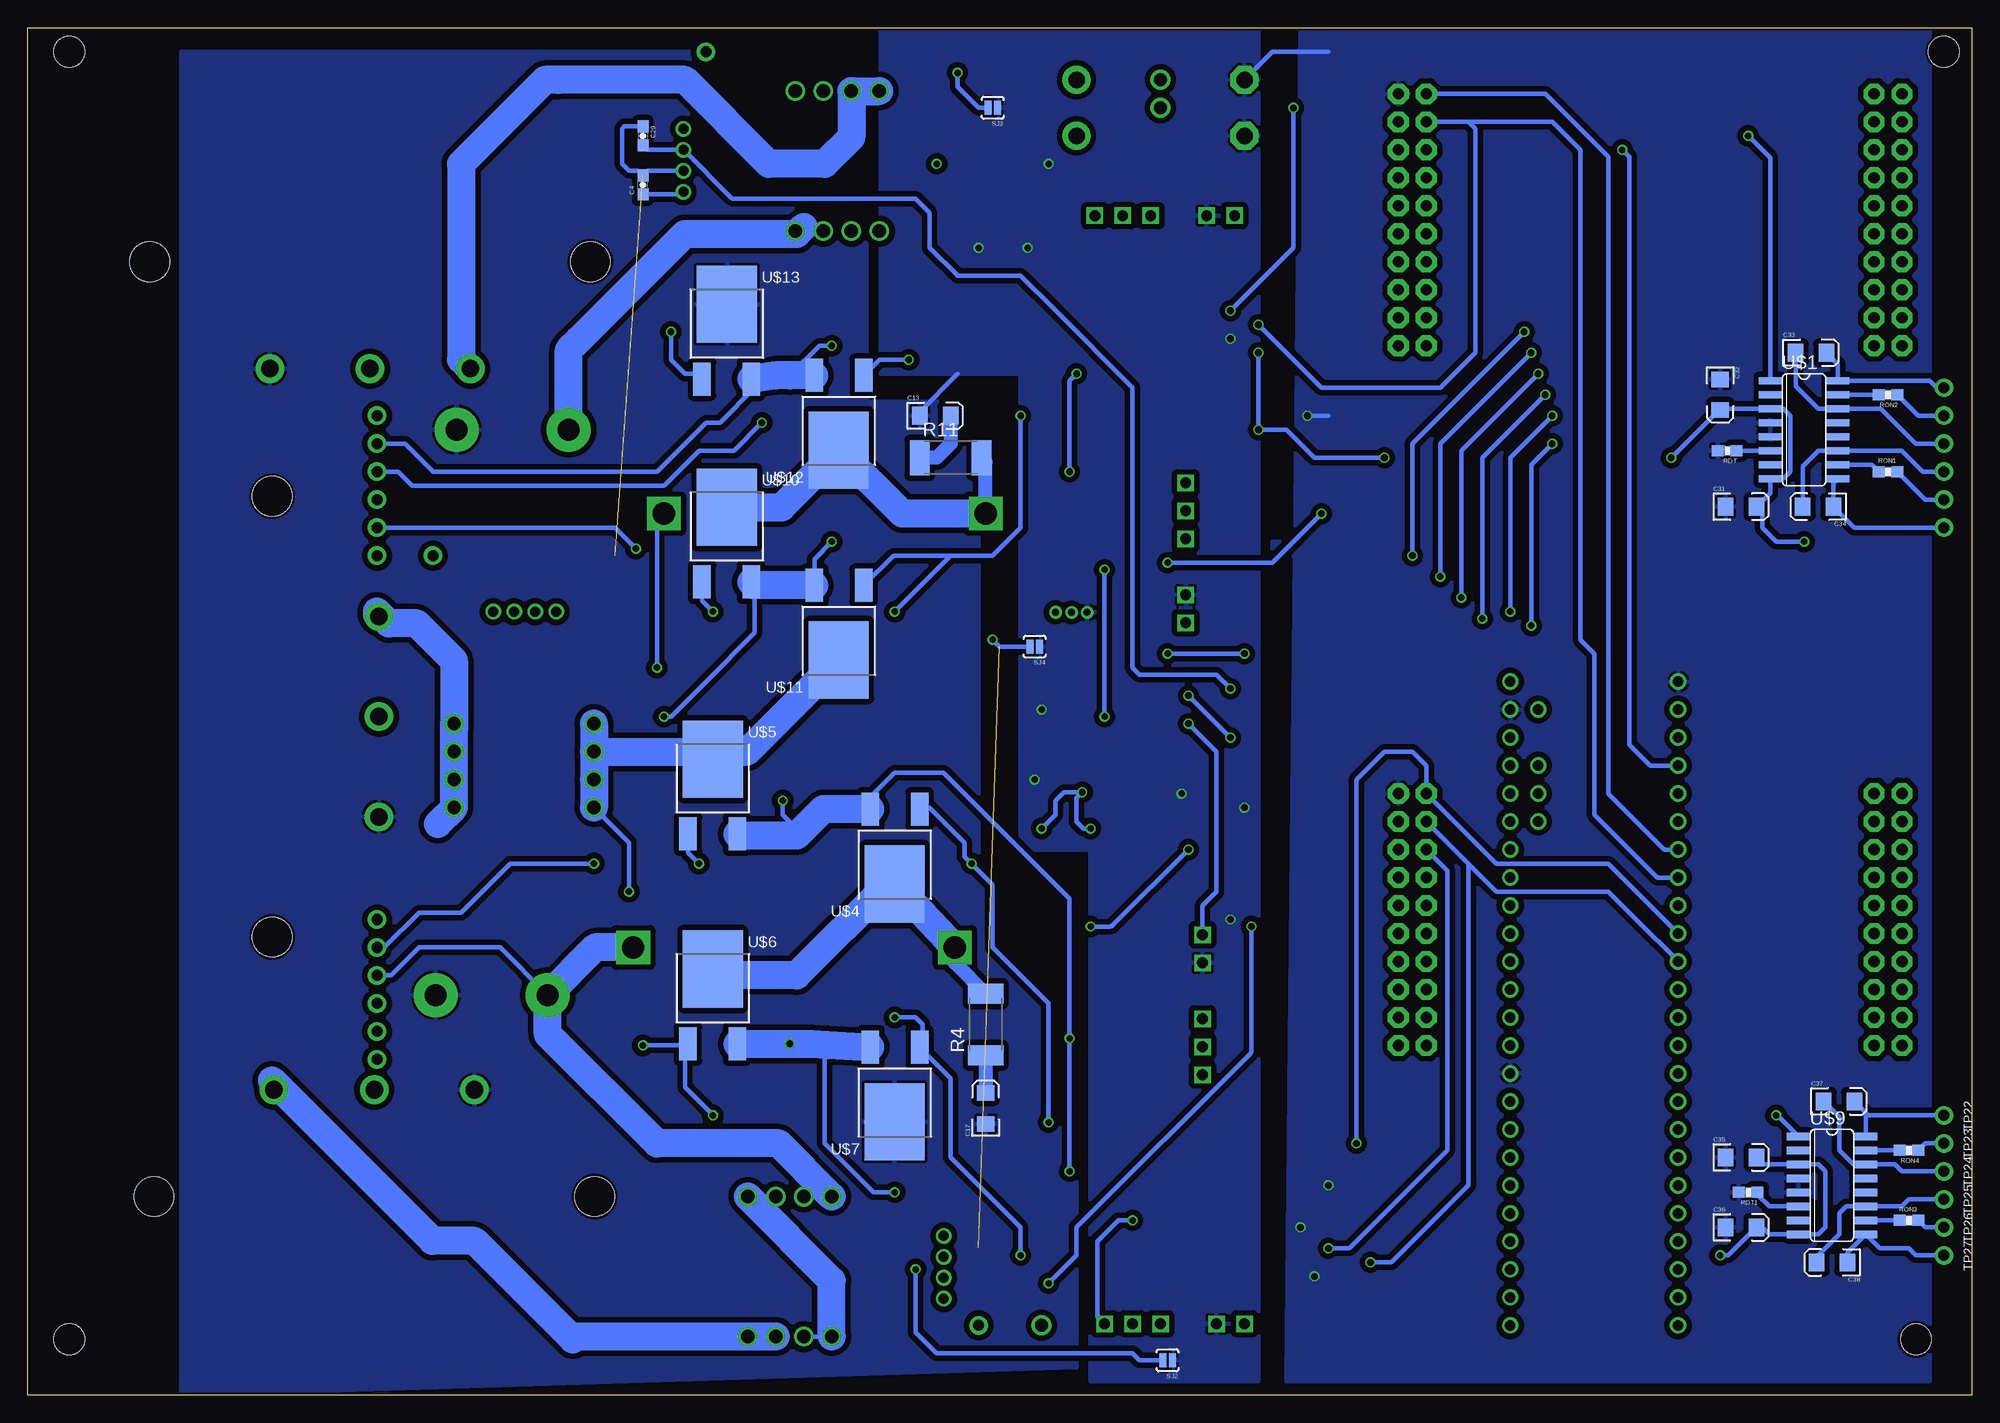
[diagram p6: board, bottom side, seen from below]

Size 176.51 x 124.13 mm. Coordinates in mm from the lower left corner, seen from the top.
Outline: 0,0 176.51,0 176.51,124.13 0,124.13 0,0
Copper layers (1*16): Top 0.035mm / dielectric 1.5mm / Bottom 0.035mm
Design rules "SeeedStudio_2layer_DRU_no_angle_20140221": minimum track width 6mil, minimum drill 12mil, track to track 6mil, track to pad 6mil, pad to pad 6mil, via to via 6mil, smd to smd 0mil, copper to edge 10mil, drill to drill 10mil, minimum pad ring 10mil, minimum via ring 6mil, stop-mask expansion 2mil, vias tented up to drill 100mil, thermal gap 10mil
Holes 2.8 mm at 172.72,121.92 172.72,5.08 2.54,121.92 5.08,5.08

### Footprints (pad centres in the part's own frame; a part is rotated, then mirrored left to right if it is on the bottom)
TO252 = smd 1 x 1.6: 1 -2.28,-4.8; 2 2.28,-4.8 | smd 5.4 x 6.2: 3 0,2.5
6ESRM-P = drill 1.6 pad 2.6: 1 -9.1,9.7; 2 0,9.7; 3 9.1,9.7 | hole 3.6: -20,0; 20,0
SSO-6 = smd 1.85 x 0.65: 1 -5.325,1.778; 2 -5.325,0.508; 3 -5.325,-0.762; 4 5.325,-0.762; 5 5.325,0.508; 6 5.325,1.778
SO08 = smd 0.61 x 2.21: 1 -1.905,-2.616; 2 -0.635,-2.616; 3 0.635,-2.616; 4 1.905,-2.616; 5 1.905,2.616; 6 0.635,2.616; 7 -0.635,2.616; 8 -1.905,2.616
0603-CAP = smd 1.1 x 1: 1 -0.85,0; 2 0.85,0
PANASONIC_C = smd 2.2 x 0.65: + 1.9,-0.2; - -1.8,-0.2
EIA3216 = smd 1.4 x 1.6: A 1.4,0; C -1.4,0
CUI_PDM2 = drill 0.991 square: 1 2.54,5.842; 2 5.08,5.842; 4 10.16,5.842; 5 12.7,5.842; 6 15.24,5.842
SOD-323 = smd 0.63 x 0.83: 1 -1.15,0; 2 1.15,0
1X01_ROUND = drill 1 pad 1.676: 1 0,0
F03P_THRU_HOLE = drill 0.9: GND -7.62,2.159; VCC -7.62,4.064; VOUT -7.62,0.254; VREF -7.62,-1.651 | drill 1.2: IN2 2.54,7.62; IN3 5.08,7.62; IN4 7.62,7.62; IN5 10.16,7.62; OUT6 10.16,-5.08; OUT7 7.62,-5.08; OUT8 5.08,-5.08; OUT9 2.54,-5.08
SJ_3 = smd 0.635 x 1.27: 1 -0.889,0; 2 0,0; 3 0.889,0
BOUNRS_330UH = drill 2.032 square: P$1 14.605,0; P$2 -14.605,0
LMT87_TO = drill 0.635: GND 0.305,-1.346; OUT 1.727,-1.346; VDD 3.175,-1.321
0603-RES = smd 1.1 x 1: 1 -0.85,0; 2 0.85,0
R2512 = smd 1.8 x 3.2: 1 -2.8,0; 2 2.8,0
TO-247-2V = drill 2 pad 4: 1 -5.08,0; 2 5.08,0
1206 = smd 1.6 x 1.8: 1 -1.4,0; 2 1.4,0
SJ_2S-NOTRACE = smd 0.635 x 1.27: 1 -0.45,0; 2 0.4,0
SO16 = smd 0.66 x 2.032: 1 -3.175,-3.073; 2 -1.905,-3.073; 3 -0.635,-3.073; 4 0.635,-3.073; 5 1.905,-3.073; 6 3.175,-3.073; 7 4.445,-3.073; 8 5.715,-3.073; 9 5.715,3.073; 10 4.445,3.073; 11 3.175,3.073; 12 1.905,3.073; 13 0.635,3.073; 14 -0.635,3.073; 15 -1.905,3.073; 16 -3.175,3.073
DPAK = smd 1.6 x 2.997: 1 -2.261,-4.928; 3 2.21,-4.928 | smd 5.452 x 7: 4 0,1.853
SO16L = smd 0.66 x 2.032: 1 -4.445,-4.902; 2 -3.175,-4.902; 3 -1.905,-4.902; 4 -0.635,-4.902; 5 0.635,-4.902; 6 1.905,-4.902; 7 3.175,-4.902; 8 4.445,-4.902; 9 4.445,4.902; 10 3.175,4.902; 11 1.905,4.902; 12 0.635,4.902; 13 -0.635,4.902; 14 -1.905,4.902; 15 -3.175,4.902; 16 -4.445,4.902
TIVA-C-LP-BOOSTER-PACK = drill 1.016 pad 1.88 octagon: 1 36.83,52.07; 2 36.83,54.61; 3 39.37,52.07; 4 39.37,54.61; 5 41.91,52.07; 6 41.91,54.61; 7 44.45,52.07; 8 44.45,54.61; 9 46.99,52.07; 10 46.99,54.61; 11 49.53,52.07; 12 49.53,54.61; 13 52.07,52.07; 14 52.07,54.61; 15 54.61,52.07; 16 54.61,54.61; 17 57.15,52.07; 18 57.15,54.61; 19 59.69,52.07; 20 59.69,54.61; 21 36.83,8.89; 22 36.83,11.43; 23 39.37,8.89; 24 39.37,11.43; 25 41.91,8.89; 26 41.91,11.43; 27 44.45,8.89; 28 44.45,11.43; 29 46.99,8.89; 30 46.99,11.43; 31 49.53,8.89; 32 49.53,11.43; 33 52.07,8.89; 34 52.07,11.43; 35 54.61,8.89; 36 54.61,11.43; 37 57.15,8.89; 38 57.15,11.43; 39 59.69,8.89; 40 59.69,11.43; 41 100.33,8.89; 42 100.33,11.43; 43 102.87,8.89; 44 102.87,11.43; 45 105.41,8.89; 46 105.41,11.43; 47 107.95,8.89; 48 107.95,11.43; 49 110.49,8.89; 50 110.49,11.43; 51 113.03,8.89; 52 113.03,11.43; 53 115.57,8.89; 54 115.57,11.43; 55 118.11,8.89; 56 118.11,11.43; 57 120.65,8.89; 58 120.65,11.43; 59 123.19,8.89; 60 123.19,11.43; 61 100.33,52.07; 62 100.33,54.61; 63 102.87,52.07; 64 102.87,54.61; 65 105.41,52.07; 66 105.41,54.61; 67 107.95,52.07; 68 107.95,54.61; 69 110.49,52.07; 70 110.49,54.61; 71 113.03,52.07; 72 113.03,54.61; 73 115.57,52.07; 74 115.57,54.61; 75 118.11,52.07; 76 118.11,54.61; 77 120.65,52.07; 78 120.65,54.61; 79 123.19,52.07; 80 123.19,54.61
TEENSY_3.5_DIL+4 = drill 0.965: 0 -7.62,26.67; 1 -7.62,24.13; 2 -7.62,21.59; 3 -7.62,19.05; 3.3V 7.62,24.13; 3.3V3 -7.62,-6.35; 4 -7.62,16.51; 5 -7.62,13.97; 6 -7.62,11.43; 7 -7.62,8.89; 8 -7.62,6.35; 9 -7.62,3.81; 10 -7.62,1.27; 11 -7.62,-1.27; 12 -7.62,-3.81; 13 7.62,-3.81; 14/A0 7.62,-1.27; 15/A1 7.62,1.27; 16/A2 7.62,3.81; 17/A3 7.62,6.35; 18/A4 7.62,8.89; 19/A5 7.62,11.43; 20/A6 7.62,13.97; 21/A7 7.62,16.51; 22/A8 7.62,19.05; 23/A9 7.62,21.59; 24 -7.62,-8.89; 25 -7.62,-11.43; 26 -7.62,-13.97; 27 -7.62,-16.51; 28 -7.62,-19.05; 29 -7.62,-21.59; 30 -7.62,-24.13; 31/A12 -7.62,-26.67; 32/A13 -7.62,-29.21; 33/A14 7.62,-29.21; 34/A15 7.62,-26.67; 35/A16 7.62,-24.13; 36/A17 7.62,-21.59; 37/A18 7.62,-19.05; 38/A19 7.62,-16.51; 39/A20 7.62,-13.97; A10 5.08,19.05; A11 5.08,16.51; A21 7.62,-11.43; A22 7.62,-8.89; AGND 7.62,26.67; AREF 5.08,21.59; GND -7.62,29.21; GND1 7.62,-6.35; VIN 7.62,29.21; VUSB 5.08,26.67
SPADE-GROUND = drill 1.5 pad 2.54 octagon: P$1 0,-2.54; P$2 0,2.54
SPADE-POWER = drill 1.5 pad 2.54: P$1 0,-2.54; P$2 0,2.54

### Placement (x,y rotation side)
7805  88.27,114.3 0 top
AC_IN  154.31,61.59 90 top
AC_OUT_1  145.41,102.87 180 top
AC_OUT_2  145.03,18.03 0 top
ACPL_W346  73.66,90.93 0 top
ADUM_3220  73.03,97.79 270 top
C1  133.99,74.93 180 top
C2  74.3,103.5 90 top
C3  71.12,103.5 90 top
C4  120.65,109.86 90 bottom
C5  132.08,43.18 270 top
C6  72.39,38.1 270 top
C7  66.93,9.53 0 top
C8  128.4,80.64 180 top
C9  67.56,71.37 90 top
C10  69.22,111.12 0 top
C11  67.18,82.17 270 top
C12  78.11,111.12 180 top
C13  94.11,88.9 0 bottom
C14  79.38,87.63 0 top
C15  72.39,31.75 90 top
C16  77.6,9.27 180 top
C17  89.53,26.04 90 bottom
C18  73.66,24.77 0 top
C19  71.75,16.51 180 top
C20  65.66,14.86 180 top
C21  90.17,14.22 270 top
C22  67.94,57.15 270 top
C23  67.94,46.35 270 top
C24  67.94,52.07 90 top
C25  81.28,73.66 0 top
C26  86.11,106.43 270 top
C27  90.42,106.43 270 top
C28  130.18,74.93 0 top
C29  120.65,114.3 270 bottom
C30  90.04,10.41 270 top
C31  20.95,80.64 0 bottom
C32  22.86,90.81 270 bottom
C33  14.61,94.61 0 bottom
C34  13.97,80.64 180 bottom
C35  20.95,21.59 0 bottom
C36  20.95,15.24 0 bottom
C37  12.06,26.67 0 bottom
C38  12.7,12.06 180 bottom
CUI_12-12_1  64.39,101.22 0 top
CUI_12-12_2  77.22,67.56 90 top
CUI_12-12_3  64.01,44.32 270 top
CUI_12-12_4  63.5,0.64 0 top
DUAL_GD2  71.63,12.7 270 top
DZ1  70.48,57.15 270 top
DZ2  70.48,46.35 270 top
DZ3  70.48,52.07 90 top
HI_G  144.78,78.74 180 top
HI_G2  144.78,40.64 90 top
HI_S  144.78,76.2 180 top
HI_S2  144.78,43.18 90 top
I_APP1  114.94,121.92 0 top
I_APP2  90.17,6.35 0 top
I_SENSE_1  130.18,63.5 270 top
I_SENSE_2  109.35,113.28 180 top
I_SENSE_3  100.97,10.41 0 top
JP1  63.5,50.8 270 top
JP2  63.5,54.61 270 top
JP3  63.5,46.99 270 top
JP4  63.5,58.42 270 top
JP5  63.5,62.87 270 top
JP6  63.5,43.18 270 top
JP7  63.5,67.31 270 top
L1  106.93,40.64 180 top
L2  104.14,80.01 180 top
LMT_87  80.01,72.39 0 top
LO_G1+  144.78,88.9 180 top
LO_G1-  144.78,83.82 180 top
LO_G2+  144.78,30.48 90 top
LO_G2-  144.78,33.02 90 top
LO_S1  144.78,86.36 180 top
LO_S2  144.78,35.56 90 top
R1  80.14,22.86 270 top
R2  78.11,13.46 0 top
R3  78.11,11.68 0 top
R4  89.53,33.66 90 bottom
R5  63.12,19.3 0 top
R6  63.12,21.84 0 top
R7  134.37,36.32 180 top
R8  83.82,90.68 180 top
R9  80.64,99.69 0 top
R10  80.64,97.16 0 top
R11  92.71,85.09 0 bottom
R12  64.77,90.17 0 top
R13  64.77,92.71 0 top
R14  132.46,87.63 180 top
R15  83.82,59.69 180 top
R16  80.01,59.69 180 top
R17  73.66,59.69 90 top
R18  73.66,54.61 90 top
R19  73.66,43.43 270 top
R20  73.66,49.53 270 top
R21  85.6,44.58 0 top
R22  79.5,44.58 0 top
RDT  22.23,85.72 180 bottom
RDT1  20.32,18.41 180 bottom
RON1  7.62,83.82 0 bottom
RON2  7.62,90.81 180 bottom
RON3  5.71,15.88 0 bottom
RON4  5.71,22.23 180 bottom
SINGLE_GD2  72.14,20.7 0 top
SJ2  73.03,3.17 180 bottom
SJ3  88.9,116.84 180 bottom
SJ4  85.09,67.94 180 bottom
TP13  139.7,76.2 0 top
TP22  2.54,25.4 270 bottom
TP23  2.54,22.86 270 bottom
TP24  2.54,20.32 270 bottom
TP25  2.54,17.78 270 bottom
TP26  2.54,15.24 270 bottom
TP27  2.54,12.7 270 bottom
U$1  15.24,88.9 270 bottom
U$4  97.79,48.26 180 bottom
U$5  114.3,55.88 0 bottom
U$6  114.3,36.83 0 bottom
U$7  97.79,26.67 180 bottom
U$9  12.7,20.32 270 bottom
U$10  113.03,78.74 0 bottom
U$11  102.87,68.58 180 bottom
U$12  102.87,87.63 180 bottom
U$13  113.03,97.16 0 bottom
U$15  82.3,52.07 270 top
U$17  60.96,-5.08 90 top
U$19  34.29,35.56 0 top
U$21  66.04,116.84 0 top
U$23  81.28,116.84 0 top
VDD_H1  2.54,91.44 270 top
VDD_L1  2.54,83.82 270 top
VO  144.78,81.28 180 top
VO2  144.78,38.1 90 top
VO_H1  2.54,88.9 270 top
VO_L1  2.54,81.28 270 top
VSS_H1  2.54,86.36 270 top
VSS_L1  2.54,78.74 270 top

### Tracks (layer width: path | path; a pad name or v marks a point on that pad's centre or on a via)
1V6  (via drill 0.6)
  Top 0.406: U$15.3 79.38,53.98 80.01,53.98 v80.77,54.73 arc45 80.86,54.96 R16.1 R15.2 | v84.45,51.44 U$15.12 | U$15.5 v80.01,51.44
  Bottom 0.406: v84.45,51.44 83.19,52.7 83.19,53.98 82.43,54.73 v80.77,54.73 81.28,54.22 81.28,52.07 80.64,51.44 v80.01,51.44
3V3  (via drill 0.6)
  Top 0.406: v78.74,61.59 78.74,60.11 R16.2 | v78.74,74.93 78.74,75.56 78.11,76.2 73.66,76.2 v73.03,75.56 | v59.05,80.01 58.42,80.64 53.98,80.64 53.34,81.28
  Bottom 0.406: v78.74,61.59 v78.74,74.93 | v73.03,75.56 63.5,75.56 v59.05,80.01
  pour Top: 3.81,124.46 54.61,124.46 55.88,27.94 48.26,27.94 48.26,7.62 3.81,7.62
5V  (via drill 0.6)
  Top 0.406: C20.1 68.76,14.86 DUAL_GD2.1 | 7805.2 91.44,109.5 | 91.44,109.5 91.72,109.5 v93.98,111.76 | C27.1 90.42,108.48 91.44,109.5 | C1.1 134.84,71.72 I_SENSE_1.VCC
  Bottom 0.406: C4.1 117.18,109 I_SENSE_2.VCC
  pour Top: 93.98,120.65 93.98,106.68 91.44,104.14 71.12,104.14 69.22,101.6 69.22,80.64 71.12,78.74 76.2,78.74 76.83,78.11 76.83,73.03 78.11,28.57 78.11,27.3 73.66,22.86 67.94,18.41 66.67,17.14 66.67,8.89 70.48,8.89 71.12,6.99 71.12,2.54 169.54,2.54 169.54,120.65
+12V  (via drill 0.6)
  Top 0.406: C7.1 66.08,6.52 CUI_12-12_4.1 | v53.34,85.09 29.21,85.09 | 29.21,85.09 27.94,85.09 | v27.3,85.09 29.21,85.09 | v22.86,12.7 48.26,12.7 53.34,7.62
  Bottom 0.406: CUI_12-12_3.1 69.85,44.45 68.58,45.72 68.58,58.42 v71.12,60.96 | v64.77,94.61 v64.77,87.63 62.23,87.63 59.69,85.09 v53.34,85.09 | v15.24,77.47 17.78,77.47 19.05,78.74 19.05,80.14 C31.A 18.31,81.89 U$1.8 17.14,83.19 16.51,83.82 16.51,88.9 17.14,89.53 U$1.3 22.73,89.53 C32.A 22.99,89.41 v27.3,85.09 | C35.A 19.55,21.46 19.05,20.95 U$9.3 13.97,20.95 13.34,20.32 13.34,15.24 13.97,14.61 U$9.8 18.41,14.61 19.05,15.24 C36.A 22.09,12.7 v22.86,12.7
  pour Top: 59.05,120.65 88.9,120.65 88.9,105.41 67.94,105.41 67.94,76.83 74.93,77.47 74.93,26.67 63.5,17.78 63.5,7.62 67.31,7.62 67.31,0 50.8,0 50.8,25.4 58.42,25.4
DGND  (via drill 0.6)  (2 unrouted)
  Top 0.406: 91.44,12.57 I_SENSE_3.GND 94.74,12.57 v95.89,11.43 | 91.44,12.57 91.1,12.57 arc-45 90.88,12.67 C21.2 | C30.1 arc45 90.19,11.33 91.44,12.57 | I_SENSE_2.GND 114.94,111.12 111.12,114.94 111.12,118.75 109.22,120.65 92.71,120.65 v92.08,120.02 | v88.9,68.58 115.57,68.58 123.19,76.2 130.18,76.2 130.81,75.56 130.81,75.14 C28.2 C1.2 133.35,74.72 133.35,73.66 132.33,72.64 I_SENSE_1.GND
  Bottom 0.406: v95.89,11.43 95.89,5.71 93.98,3.81 76.2,3.81 75.56,3.17 SJ2.2 | I_SENSE_2.GND 120.23,111.12 C4.2 121.07,111.12 121.92,111.12 122.56,111.76 122.56,114.94 122.34,115.15 C29.1 | v92.08,120.02 92.08,118.75 90.17,116.84 SJ3.2 | SJ4.2 88.27,67.94 v88.9,68.58
GND  (via drill 0.6)
  Top 0.406: CUI_12-12_2.2 67.98,72.64 C9.2 | C10.2 70.06,107.66 CUI_12-12_1.2 70.1,107.06 71.12,106.05 C3.2 | C6.2 71.84,37.25 CUI_12-12_3.2 | C20.2 61.34,14.86 v60.96,15.24 | R5.1 58.67,19.3 v58.42,19.05 | v59.69,10.79 DUAL_GD2.4 67.78,9.56 C7.2 67.78,9.06 68.58,8.26 CUI_12-12_4.2 | R15.1 84.67,62.02 v84.45,62.23 | U$15.13 85.72,52.7 85.09,53.34 v85.09,55.88 | C26.2 86.11,104.52 v85.72,104.14 | C27.2 90.42,104.39 v90.17,104.14 | ADUM_3220.4 v67.31,95.89 | DZ3.2 68.25,53.22 C24.2 66.46,52.92 v66.04,53.34 | C22.2 68.25,56 DZ1.2 70.48,55.88 v71.75,54.61 | DZ2.2 68.25,45.2 C23.2 67.94,43.81 v67.31,43.18 | C25.1 80.43,71.16 LMT_87.GND | 130.76,80.84 C8.- | 7805.3 v83.82,111.76 | R12.1 61.59,90.17 v60.33,88.9
  Top 2.54: R7.1 139.45,43.43 137.16,45.72 132.62,45.72 C5.- | 130.76,80.84 R14.1
  Bottom 0.406: C13.C 95.51,89.28 92.08,92.71 | v60.33,88.9 58.42,88.9 | U$21.P$2 63.5,121.92 58.42,121.92
  pour Bottom: 100.33,90.17 100.33,121.92 162.56,121.92 162.56,0 81.28,2.54 81.28,46.99 90.17,46.99 90.17,90.17
  pour Bottom: 64.77,124.46 99.06,124.46 99.06,92.71 86.36,92.71 86.36,49.53 80.01,49.53 80.01,1.27 64.77,1.27
  pour Bottom: 3.81,124.46 60.96,124.46 62.23,1.27 3.81,1.27
  pour Bottom: 63.5,77.47 59.69,77.47 59.69,76.2 63.5,76.2
HI_G1  (via drill 0.6)
  Top 0.406: R8.1 84.67,90.59 v86.36,88.9 | v97.79,71.12 v114.3,71.12 120.02,76.83 v121.28,76.83
  Bottom 0.406: v86.36,88.9 86.36,78.74 88.9,76.2 92.71,76.2 | 92.71,76.2 97.92,76.2 U$11.1 | U$10.1 115.29,73.03 115.29,72.11 v114.3,71.12 | v97.79,71.12 92.71,76.2 | HI_G.1 123.19,78.74 v121.28,76.83
HI_G2  (via drill 0.6)
  Top 0.406: v90.81,48.26 v115.57,48.26 v125.09,48.26 | R1.1 82.77,23.71 v83.82,24.77
  Bottom 0.406: v83.82,24.77 83.82,35.56 86.36,38.1 88.9,40.64 88.9,46.35 v90.81,48.26 91.44,48.9 91.44,50.16 94.61,53.34 95.38,53.34 U$4.1 | U$5.1 116.56,49.25 v115.57,48.26 | HI_G2.1 144.15,40.64 140.97,43.81 137.16,43.81 132.72,48.26 v125.09,48.26
HI_PS1  (via drill 0.6)
  Top 0.406: C11.1 71.16,83.02 | 71.16,83.02 CUI_12-12_2.6 | C14.1 77.47,87.63 76.2,88.9 76.2,92.08 76.83,92.71 ACPL_W346.6 v81.28,92.71 | 71.16,83.02 81.11,83.02 v81.92,83.82
  Bottom 0.406: v81.92,83.82 81.92,92.08 v81.28,92.71
HI_PS2
  Top 0.406: C18.1 69.85,27.73 CUI_12-12_3.6 70.57,29.08 C15.1 | 73.03,24.55 C18.1 | SINGLE_GD2.6 74.04,22.48 73.03,23.5 73.03,24.55 | 73.03,24.55 C18.1
HI_S1  (via drill 0.6)
  Top 0.406: v103.5,77.47 102.23,76.2 85.72,76.2 84.45,77.47 71.63,77.47 CUI_12-12_2.4 70.99,78.11 69.22,78.11 67.18,80.14 C11.2 67.14,81.28 66.17,81.28 arc-45 65.95,81.37 65.41,81.92 65.41,84.45 66.04,85.09 72.39,85.09 79.38,85.09 80.01,85.72 80.01,87.42 C14.2 80.64,88.05 80.64,89.53 80.01,90.17 ACPL_W346.4 | HI_S.1 133.35,64.77 124.46,64.77 121.28,61.59 v118.75,61.59
  Bottom 0.406: U$11.3 105.08,75.89 v103.5,77.47 | v118.75,61.59 118.11,61.59 114.94,64.77 110.49,69.22 110.49,73.48 U$10.3
  Bottom 2.54: U$11.3 110.52,73.51 U$10.3
HI_S2  (via drill 0.6)
  Top 0.406: CUI_12-12_3.4 71.88,34.16 72.39,33.66 C15.2 72.61,32.38 73.66,32.38 74.51,31.54 | C18.2 74.51,31.54 | 74.51,31.54 81.06,31.54 v81.92,32.38 | SINGLE_GD2.4 81.53,19.94 v81.92,20.32 | HI_S2.1 144.78,47.62 142.24,50.16 119.38,50.16 114.94,54.61 108.58,54.61 v107.95,53.98
  Bottom 0.406: U$4.3 99.69,53.49 99.69,54.61 97.79,56.52 93.34,56.52 81.92,45.09 v81.92,32.38 v81.92,20.32 | v107.95,53.98 107.95,52.7 106.36,51.12
  Bottom 2.54: U$4.3 104.29,53.19 106.36,51.12 106.68,50.8 111.76,50.8 111.91,50.95 U$5.3
I_APP1  (via drill 0.6)
  Top 0.406: v67.31,64.14 66.77,63.59 arc-45 66.54,63.5 65.91,62.87 JP5.2 | I_SENSE_2.VOUT 116.2,113.03 114.94,114.3 I_APP1.1
  Bottom 0.406: 76.2,69.22 76.2,91.31 arc-45 76.29,91.53 83.26,98.5 86.36,101.6 91.97,101.6 arc45 92.15,101.67 94.61,104.14 94.61,107.21 arc-45 94.69,107.39 95.89,108.58 112.42,108.58 arc45 112.6,108.66 I_SENSE_2.VOUT 120.23,113.03 C29.2 | 76.2,69.22 76.2,68.58 | 76.2,69.22 76.2,66.17 arc-45 76.11,65.95 75.56,65.41 68.73,65.41 arc45 68.5,65.31 67.34,64.15 arc-45 v67.31,64.14
I_APP1_TI  (via drill 0.6)
  Top 0.406: JP5.1 63.25,63.75 v50.8,76.2 | v40.64,96.52 40.01,96.52 23.5,113.03 U$17.75
  Bottom 0.406: v50.8,76.2 50.8,86.36 v40.64,96.52
I_APP2  (via drill 0.6)
  Top 0.406: v83.82,10.16 88.77,10.16 arc-45 88.99,10.07 89.53,9.53 89.95,9.53 | 89.95,9.53 arc45 C30.2 92.11,9.56 arc45 92.33,9.66 I_SENSE_3.VOUT | JP6.2 64.77,43.18 v65.41,42.55 | 89.95,9.53 89.95,6.57 I_APP2.1
  Bottom 0.406: v83.82,10.16 81.37,12.61 arc-45 81.28,12.83 81.28,15.24 65.51,31.01 arc-45 65.42,31.23 65.41,31.25 v65.41,42.55
I_APP2_TI  (via drill 0.6)
  Top 0.406: JP6.1 62.61,44.07 59.05,47.62 59.05,51.44 52.07,58.42 51.44,58.42 v40.01,69.85 | v38.1,86.36 35.56,86.36 20.95,100.97 9.53,100.97 U$17.65
  Bottom 0.406: v40.01,69.85 40.01,84.45 v38.1,86.36
I_MAIN  (via drill 0.6)
  Top 0.406: 130.18,70.48 128.36,68.67 arc-45 128.14,68.58 118.75,68.58 115.66,65.5 arc-45 115.44,65.41 73.03,65.41 v71.12,63.5 | 130.18,70.48 130.18,70.73 arc-45 130.27,70.96 I_SENSE_1.VOUT 130.18,71.37 130.18,72.39 | JP4.2 64.77,58.42 66.04,59.69 v67.31,59.69 | C28.1 129.32,73.24 130.18,72.39 | 130.18,72.39 130.18,70.48 | 130.18,70.48 132.08,68.58 134.62,68.58 139.06,73.03 139.06,75.56 TP13.1
  Bottom 0.406: v67.31,59.69 v71.12,63.5
I_MAIN_TI  (via drill 0.6)
  Top 0.406: JP4.1 63.25,59.31 v48.26,74.3 | v40.01,94.61 24.13,110.49 U$17.73
  Bottom 0.406: v48.26,74.3 48.26,86.36 v40.01,94.61
LO_G1+  (via drill 0.6)
  Top 0.406: R9.2 114.94,99.69 v118.11,96.52 123.83,90.81 142.24,90.81 144.15,88.9 LO_G1+.1
  Bottom 0.406: v118.11,96.52 118.11,93.98 117.47,93.34 116.84,92.71 115.77,92.71 U$13.1
LO_G1-  (via drill 0.6)
  Top 0.406: R10.2 93.34,97.16 v96.52,93.98 99.69,97.16 106.68,97.16 109.86,93.98 v109.86,88.27
  Bottom 0.406: v96.52,93.98 99.19,93.98 U$12.1 | LO_G1-.1 142.88,83.82 141.6,82.55 118.75,82.55 115.57,85.72 112.39,85.72 v109.86,88.27
LO_G2+  (via drill 0.6)
  Top 0.406: R3.2 85.34,11.68 v86.36,12.7 | LO_G2+.1 101.6,30.48 v97.79,34.29
  Bottom 0.406: v86.36,12.7 86.36,15.24 92.71,21.59 92.71,28.78 U$7.1 95.25,31.88 95.25,33.66 95.89,34.29 v97.79,34.29
LO_G2-  (via drill 0.6)
  Top 0.406: R2.2 84.58,13.46 86.36,15.24 87.63,16.51 98.42,16.51 102.23,20.32 109.22,20.32 v114.3,25.4 | LO_G2-.1 144.15,33.02 142.88,31.75 v120.65,31.75
  Bottom 0.406: v120.65,31.75 116.71,31.75 U$6.1 116.84,31.62 116.84,27.94 v114.3,25.4
LO_PS1  (via drill 1.2)
  Top 0.406: ADUM_3220.8 75.64,101.04 | 75.64,101.04 79.38,104.78 79.38,106.81 CUI_12-12_1.6 79.63,110.24 79.38,110.49 78.95,110.91 C12.1 78.95,112.81 78.11,113.67 76.83,113.67 v73.66,116.84 v73.66,119.38 | 75.64,101.04 75.64,101.31 C2.1
LO_PS2  (via drill 0.6, 1.2)
  Top 0.406: C16.1 78.45,6.77 CUI_12-12_4.6 78.87,6.35 v84.45,6.35 | C19.1 73.79,16.38 74.3,15.88 74.3,14.66 | 74.3,14.66 DUAL_GD2.8 | 74.3,14.66 74.35,14.66 75.56,15.88 v76.2,15.88
  Bottom 0.406: v76.2,15.88 77.47,15.88 79.38,13.97 79.38,7.11 CUI_12-12_4.6
LO_S1  (via drill 0.6)
  Top 0.406: C12.2 77.25,110.91 74.3,107.95 74.3,107.31 CUI_12-12_1.4 74.3,106.81 C2.2 73.24,104.36 73.03,104.14 73.03,97.16 74.3,95.89 ADUM_3220.5 | ADUM_3220.5 76.2,95.89 | 76.2,95.89 78.11,95.89 79.38,94.61 92.71,94.61 95.25,92.08 99.06,92.08 102.23,95.25 v103.5,95.25 | 76.2,95.89 ADUM_3220.5
  Bottom 0.406: v103.5,95.25 104.62,95.25 107.31,92.56 | LO_S1.1 142.24,86.36 139.7,83.82 119.38,83.82 114.94,88.27 113.67,88.27 110.49,91.44 110.49,91.9 U$13.3
  Bottom 2.54: U$12.3 107.31,92.56 108.58,92.56 U$13.3
LO_S2  (via drill 0.6)
  Top 0.406: CUI_12-12_4.4 73.66,7.62 74.93,8.89 75.56,8.89 | 75.56,8.89 76.37,8.89 C16.2 | 75.56,8.89 74.24,10.21 DUAL_GD2.5 73.03,10.79 72.39,11.43 72.39,14.61 71.75,15.24 71.12,15.88 71.12,16.3 C19.2 70.48,16.55 70.48,17.14 71.12,17.78 80.64,17.78 81.28,18.41 v97.79,18.41 | LO_S2.1 144.15,35.56 142.24,33.66 141.6,33.02 108.43,33.02 v107.31,31.9
  Bottom 0.406: U$7.3 103.02,31.6 104.14,30.48 104.14,24.77 104.14,22.86 99.69,18.41 v97.79,18.41 | v107.31,31.9 106.2,31.9 105.41,31.11
  Bottom 2.54: U$6.3 v107.31,31.9 105.39,31.9 U$7.3
N$1
  Bottom 2.54: 139.28,51.86 I_SENSE_1.IN5 I_SENSE_1.IN4 I_SENSE_1.IN3 137.79,60.33 | 137.79,60.33 I_SENSE_1.IN2 | 137.79,60.33 137.79,66.67 141.18,70.06 143.72,70.06 144.78,71.12 144.78,70.87 AC_IN.3
N$2
  Top 0.406: I_SENSE_2.IN5 100.71,105.66 101.73,106.68 I_SENSE_2.IN4 | I_SENSE_2.OUT8 104.78,118.36 104.9,118.24
  Top 2.54: 101.73,106.68 101.73,109.35 106.68,114.3 106.68,118.24 | 106.68,118.24 I_SENSE_2.OUT9 | 106.68,118.24 104.9,118.24 104.78,118.11
N$3
  Bottom 0.406: I_SENSE_3.IN4 108.97,18.03 109.22,17.78 109.47,18.03 I_SENSE_3.IN5 | I_SENSE_3.OUT8 I_SENSE_3.OUT9
  Bottom 2.54: I_SENSE_3.OUT9 103.5,10.41 I_SENSE_3.IN5
N$4
  Bottom 2.54: I_SENSE_2.OUT6 I_SENSE_2.OUT7 101.73,114.17 104.14,111.76 109.22,111.76 116.84,119.38 128.31,119.38 129.54,119.38 137.16,111.76 137.16,94.02 AC_OUT_1.3
N$5
  Bottom 0.406: U$6.4 114.3,38.1
  Bottom 1.27: L1.P$1 92.33,39.25 R4.2
  Bottom 2.54: L1.P$1 93.02,41.33 U$4.4 98.37,46.41 106.68,38.1 114.3,38.1
N$6
  Bottom 1.27: R4.1 C17.A
N$7
  Top 0.406: R5.2 66.18,19.3 SINGLE_GD2.3
N$8
  Top 0.406: R6.2 63.97,22.06 64.77,22.86 66.43,22.86 SINGLE_GD2.1
N$9
  Bottom 1.27: L2.P$1 89.53,84.72 R11.2
  Bottom 2.54: U$10.4 108.05,80.59 U$12.4 97.1,80.01 L2.P$1
N$10
  Bottom 2.54: I_SENSE_3.OUT7 I_SENSE_3.OUT6 126.75,5.33 127,5.08 135.93,14.01 139.74,14.01 154.31,28.57 154.13,28.4 AC_OUT_2.3
N$11
  Bottom 1.27: C13.A 92.71,86.36 93.98,85.09 R11.1
N$12
  Top 0.406: ACPL_W346.3 R12.2
N$13
  Top 0.406: ACPL_W346.1 R13.2
N$14
  Top 0.406: ADUM_3220.7 78.53,98.42 R9.1
N$15
  Top 0.406: U$15.1 U$15.2 76.2,55.24 74.26,53.3 arc-45 74.03,53.21 R18.1
N$17
  Top 0.406: R22.1 78.1,44.95 arc-45 78.19,45.17 80.01,46.99 83.69,46.99 arc45 83.91,47.08 85.72,48.9 U$15.10 U$15.11
N$19
  Top 0.406: U$15.7 77.39,49.53 U$15.6 76.94,50.16 76.85,50.07 arc45 76.63,50.16 75.56,50.16 74.89,50.84 arc45 74.67,50.93 R20.1
N$22
  Bottom 0.406: C33.A 12.17,93.58 U$1.16 6.35,92.08 3.81,92.08 3.17,91.44 VDD_H1.1
N$23
  Top 0.406: ADUM_3220.6 R10.1
N$24
  Top 0.406: DUAL_GD2.7 77.13,13.34 R2.1
N$26
  Top 0.406: DUAL_GD2.6 76.87,12.06 R3.1
N$29
  Bottom 0.406: U$1.10 9.11,84.45 RON1.1
N$30
  Bottom 0.406: U$1.6 RDT.1
N$32
  Bottom 0.406: C33.C 16,91.57 13.97,89.53 U$1.14 | U$1.14 11.43,89.53 | 11.43,89.53 U$1.14 | 11.43,89.53 8.26,89.53 5.08,86.36 VSS_H1.1
N$33
  Bottom 0.406: C34.A 15.37,84.33 13.97,85.72 U$1.11 6.35,85.72 4.45,83.82 VDD_L1.1
N$34
  Bottom 0.406: RON1.2 4.23,81.28 VO_L1.1
N$35
  Bottom 0.406: U$1.9 12.57,82.78 C34.C 10.66,78.74 VSS_L1.1
N$36
  Bottom 0.406: U$1.15 RON2.2
N$37
  Bottom 0.406: RON2.1 4.87,88.9 VO_H1.1
N$38
  Bottom 0.406: U$9.6 18.41,17.14 19.47,18.2 RDT1.1
N$39
  Bottom 0.406: C37.A 9.63,25.63 | 9.63,25.63 U$9.16 | 9.63,25.63 9.39,25.4 TP22.1
N$40
  Bottom 0.406: C37.C 12.06,25.27 12.06,22.23 10.79,20.95 U$9.14 | U$9.14 8.89,20.95 U$9.14 | TP24.1 6.35,20.32 6.99,20.95 U$9.14
N$42
  Bottom 0.406: TP27.1 5.08,12.7 5.71,13.34 8.36,13.34 U$9.9 11.3,12.93 C38.C
N$43
  Bottom 0.406: TP25.1 5.71,17.78 6.35,17.14 6.99,17.14 U$9.11 11.43,17.14 12.06,16.51 12.06,14.61 14.1,12.57 C38.A
N$44
  Bottom 0.406: U$9.10 RON3.1
N$45
  Bottom 0.406: RON3.2 4.23,15.24 TP26.1
N$46
  Bottom 0.406: U$9.15 RON4.2
N$47
  Bottom 0.406: RON4.1 4.23,22.86 TP23.1
PWM_H1  (via drill 0.6)
  Top 0.406: U$17.56 48.26,113.03 | 48.26,113.03 47.62,113.03 47.31,112.71 | 47.31,112.71 46.99,112.39 | 48.26,113.03 v31.75,113.03 30.48,114.3 v20.32,114.3 | R13.1 48.26,92.71 46.99,93.98 46.99,112.39 | 46.99,112.39 47.31,112.71
  Bottom 0.406: v31.75,113.03 31.11,112.39 31.11,99.69 31.11,99.06 31.11,73.66 31.11,68.58 31.11,66.04 | U$1.1 18.31,94.51 18.31,112.29 v20.32,114.3 | 31.11,64.14 31.11,66.04 | U$19.2 29.21,57.15 30.48,58.42 31.11,59.05 31.11,66.04
PWM_H2  (via drill 0.6)
  Top 0.406: R6.1 56.9,21.84 v55.88,22.86 | v17.78,25.4 20.32,27.94 20.32,40.64 21.59,41.91 U$19.8
  Bottom 0.406: v55.88,22.86 55.88,55.88 53.34,58.42 50.8,58.42 49.53,57.15 U$17.40 43.18,48.26 33.02,48.26 U$19.8 | U$9.1 17.68,25.4 v17.78,25.4
PWM_L1+  (via drill 0.6)
  Top 0.406: U$17.60 48.26,119.38 48.26,120.02 48.9,120.65 58.42,120.65 61.59,117.47 v61.59,116.84 | v67.31,98.42 ADUM_3220.2
  Bottom 0.406: v61.59,116.84 61.59,104.14 v67.31,98.42 | U$17.60 38.73,118.11 33.02,112.39 33.02,68.58 33.02,59.69 | 33.02,58.42 33.02,59.69 | U$19.5 27.94,49.53 31.11,52.7 33.02,54.61 33.02,59.69
PWM_L1-  (via drill 0.6)
  Top 0.406: v64.77,97.16 ADUM_3220.3
  Bottom 0.406: U$17.58 46.99,115.57 | 46.99,115.57 45.72,115.57 45.09,114.94 45.09,94.61 48.26,91.44 59.05,91.44 v64.77,97.16 | 35.56,113.03 36.2,113.67 | 36.2,113.67 38.1,115.57 46.99,115.57 | 35.56,113.03 35.56,68.58 34.29,67.31 34.29,57.78 34.29,57.15 34.29,52.7 28.57,46.99 U$19.6 | 35.56,113.03 36.2,113.67
PWM_L2+  (via drill 0.6)
  Top 0.406: DUAL_GD2.3 v54.61,12.06
  Bottom 0.406: v54.61,12.06 52.7,12.06 45.72,19.05 45.72,45.72 45.72,48.26 | 45.72,48.26 47.94,50.48 U$17.38 | U$19.9 30.48,43.18 33.02,45.72 43.18,45.72 45.72,48.26
PWM_L2-  (via drill 0.6)
  Top 0.406: DUAL_GD2.2 v58.42,13.34 | U$19.10 28.57,36.83 32.38,40.64 34.92,43.18 43.18,43.18 U$17.36
  Bottom 0.406: v58.42,13.34 56.52,13.34 47.62,22.23 47.62,47.62 U$17.36
TEMP  (via drill 0.6)
  Top 0.406: C25.2 81.83,73.36 arc45 81.74,73.14 LMT_87.OUT 81.82,70.96 arc-45 81.92,70.73 81.92,69.85 80.01,67.94 | 79.38,67.31 80.01,67.94 | JP7.2 v66.04,67.31 | v73.03,67.31 79.38,67.31 | 79.38,67.31 80.01,67.94
  Bottom 0.406: v66.04,67.31 v73.03,67.31
TEMP_TI
  Top 0.406: JP7.1 63.5,69.22 55.24,77.47 23.5,77.47 14.61,68.58 14.61,53.34 10.79,49.53 U$17.15
V_APP1
  Top 0.406: R18.2 R17.1 70.51,58.29 arc-45 DZ1.1 68.38,58.3 arc45 68.15,58.21 C22.1 66.39,58 arc45 66.16,57.91 65.41,57.15 65.41,55.92 65.41,55.24 64.77,54.61 JP2.2
V_APP1_TI  (via drill 0.6)
  Top 0.406: JP2.1 63.25,55.5 47.62,71.12 46.99,71.75 v46.35,72.39 | v39.37,92.71 23.5,108.58 9.53,108.58 U$17.71
  Bottom 0.406: v46.35,72.39 46.35,85.72 v39.37,92.71
V_APP2
  Top 0.406: JP3.2 67.73,46.99 C23.1 68.15,47.41 arc-45 68.38,47.51 DZ2.1 71.02,48.04 arc-45 71.24,48.13 R20.2 R19.1
V_APP2_TI  (via drill 0.6)
  Top 0.406: JP3.1 62.61,47.88 60.33,50.16 60.33,52.7 v41.91,71.12 | v38.1,88.9 36.83,88.9 22.23,103.5 9.53,103.5 U$17.67
  Bottom 0.406: v41.91,71.12 41.91,85.09 v38.1,88.9
V_MAIN  (via drill 0.6)
  Top 0.406: R21.1 R22.2 80.9,43.57 arc-45 80.81,43.34 v80.01,42.55 | v71.12,49.53 71.12,50.15 arc45 71.03,50.38 DZ3.1 68.38,50.92 arc-45 68.15,51.01 C24.1 67.67,51.22 arc-45 67.45,51.31 66.93,50.8 JP1.2
  Bottom 0.406: v80.01,42.55 78.24,42.55 arc-45 78.01,42.64 v71.12,49.53
V_MAIN_TI  (via drill 0.6)
  Top 0.406: JP1.1 63.25,51.69 v44.45,70.48 | v38.73,90.81 23.5,106.05 9.53,106.05 U$17.69
  Bottom 0.406: v44.45,70.48 44.45,85.09 v38.73,90.81
VBUS  (via drill 0.6)
  Top 0.406: R21.2 120.78,44.58 v121.92,45.72
  Bottom 0.406: v121.92,45.72 121.92,50.16 I_SENSE_1.OUT6 | 114.3,58.42 U$5.4
  Bottom 2.54: I_SENSE_1.OUT9 I_SENSE_1.OUT8 | I_SENSE_1.OUT8 I_SENSE_1.OUT7 I_SENSE_1.OUT6 | I_SENSE_1.OUT8 114.3,58.42 111.18,58.42 U$11.4
VOUT1  (via drill 0.6)
  Top 0.406: R17.2 76.07,63.5 116.84,63.5 v119.38,66.04 | C8.+ 126.5,80.51 128.91,78.11 137.79,78.11 140.97,81.28 VO.1
  Top 2.54: L2.P$2 125.66,80.01 C8.+ 126.5,86.75 R14.2
  Bottom 0.406: v119.38,66.04 119.38,78.74 119.38,79.38 L2.P$2 | I_SENSE_2.IN2 106.43,106.05 106.05,106.05 104.65,106.05 I_SENSE_2.IN3
  Bottom 2.54: 106.05,106.05 106.68,105.41 116.84,105.41 126.5,95.75 127.38,94.87 R14.2
VOUT2
  Top 0.406: R19.2 74.81,42.03 81.28,35.56 116.46,35.56 L1.P$2
  Top 2.54: R7.2 129.29,38.69 C5.+
  Bottom 0.406: I_SENSE_3.IN3 I_SENSE_3.IN2 | VO2.1 143.51,38.1 140.97,40.64 133.6,40.64 R7.2
  Bottom 2.54: L1.P$2 124.97,40.64 R7.2 129.29,32.77 119.38,22.86 108.33,22.86 I_SENSE_3.IN2
VOUT_H1
  Top 0.406: SINGLE_GD2.5 79.34,21.21 R1.2
VOUT_H2
  Top 0.406: ACPL_W346.5 82.21,91.44 R8.2

### Text on the board
tDocu: v_sense
bDocu: I_sense